# EasyEDA Pro project ProPrj_PCB_PCB_PCB_PCB_STM32F103C8T6(gift)_2023-09-09_2023-10-22_2024-01-15_2025-05-12.epro, board PCB1
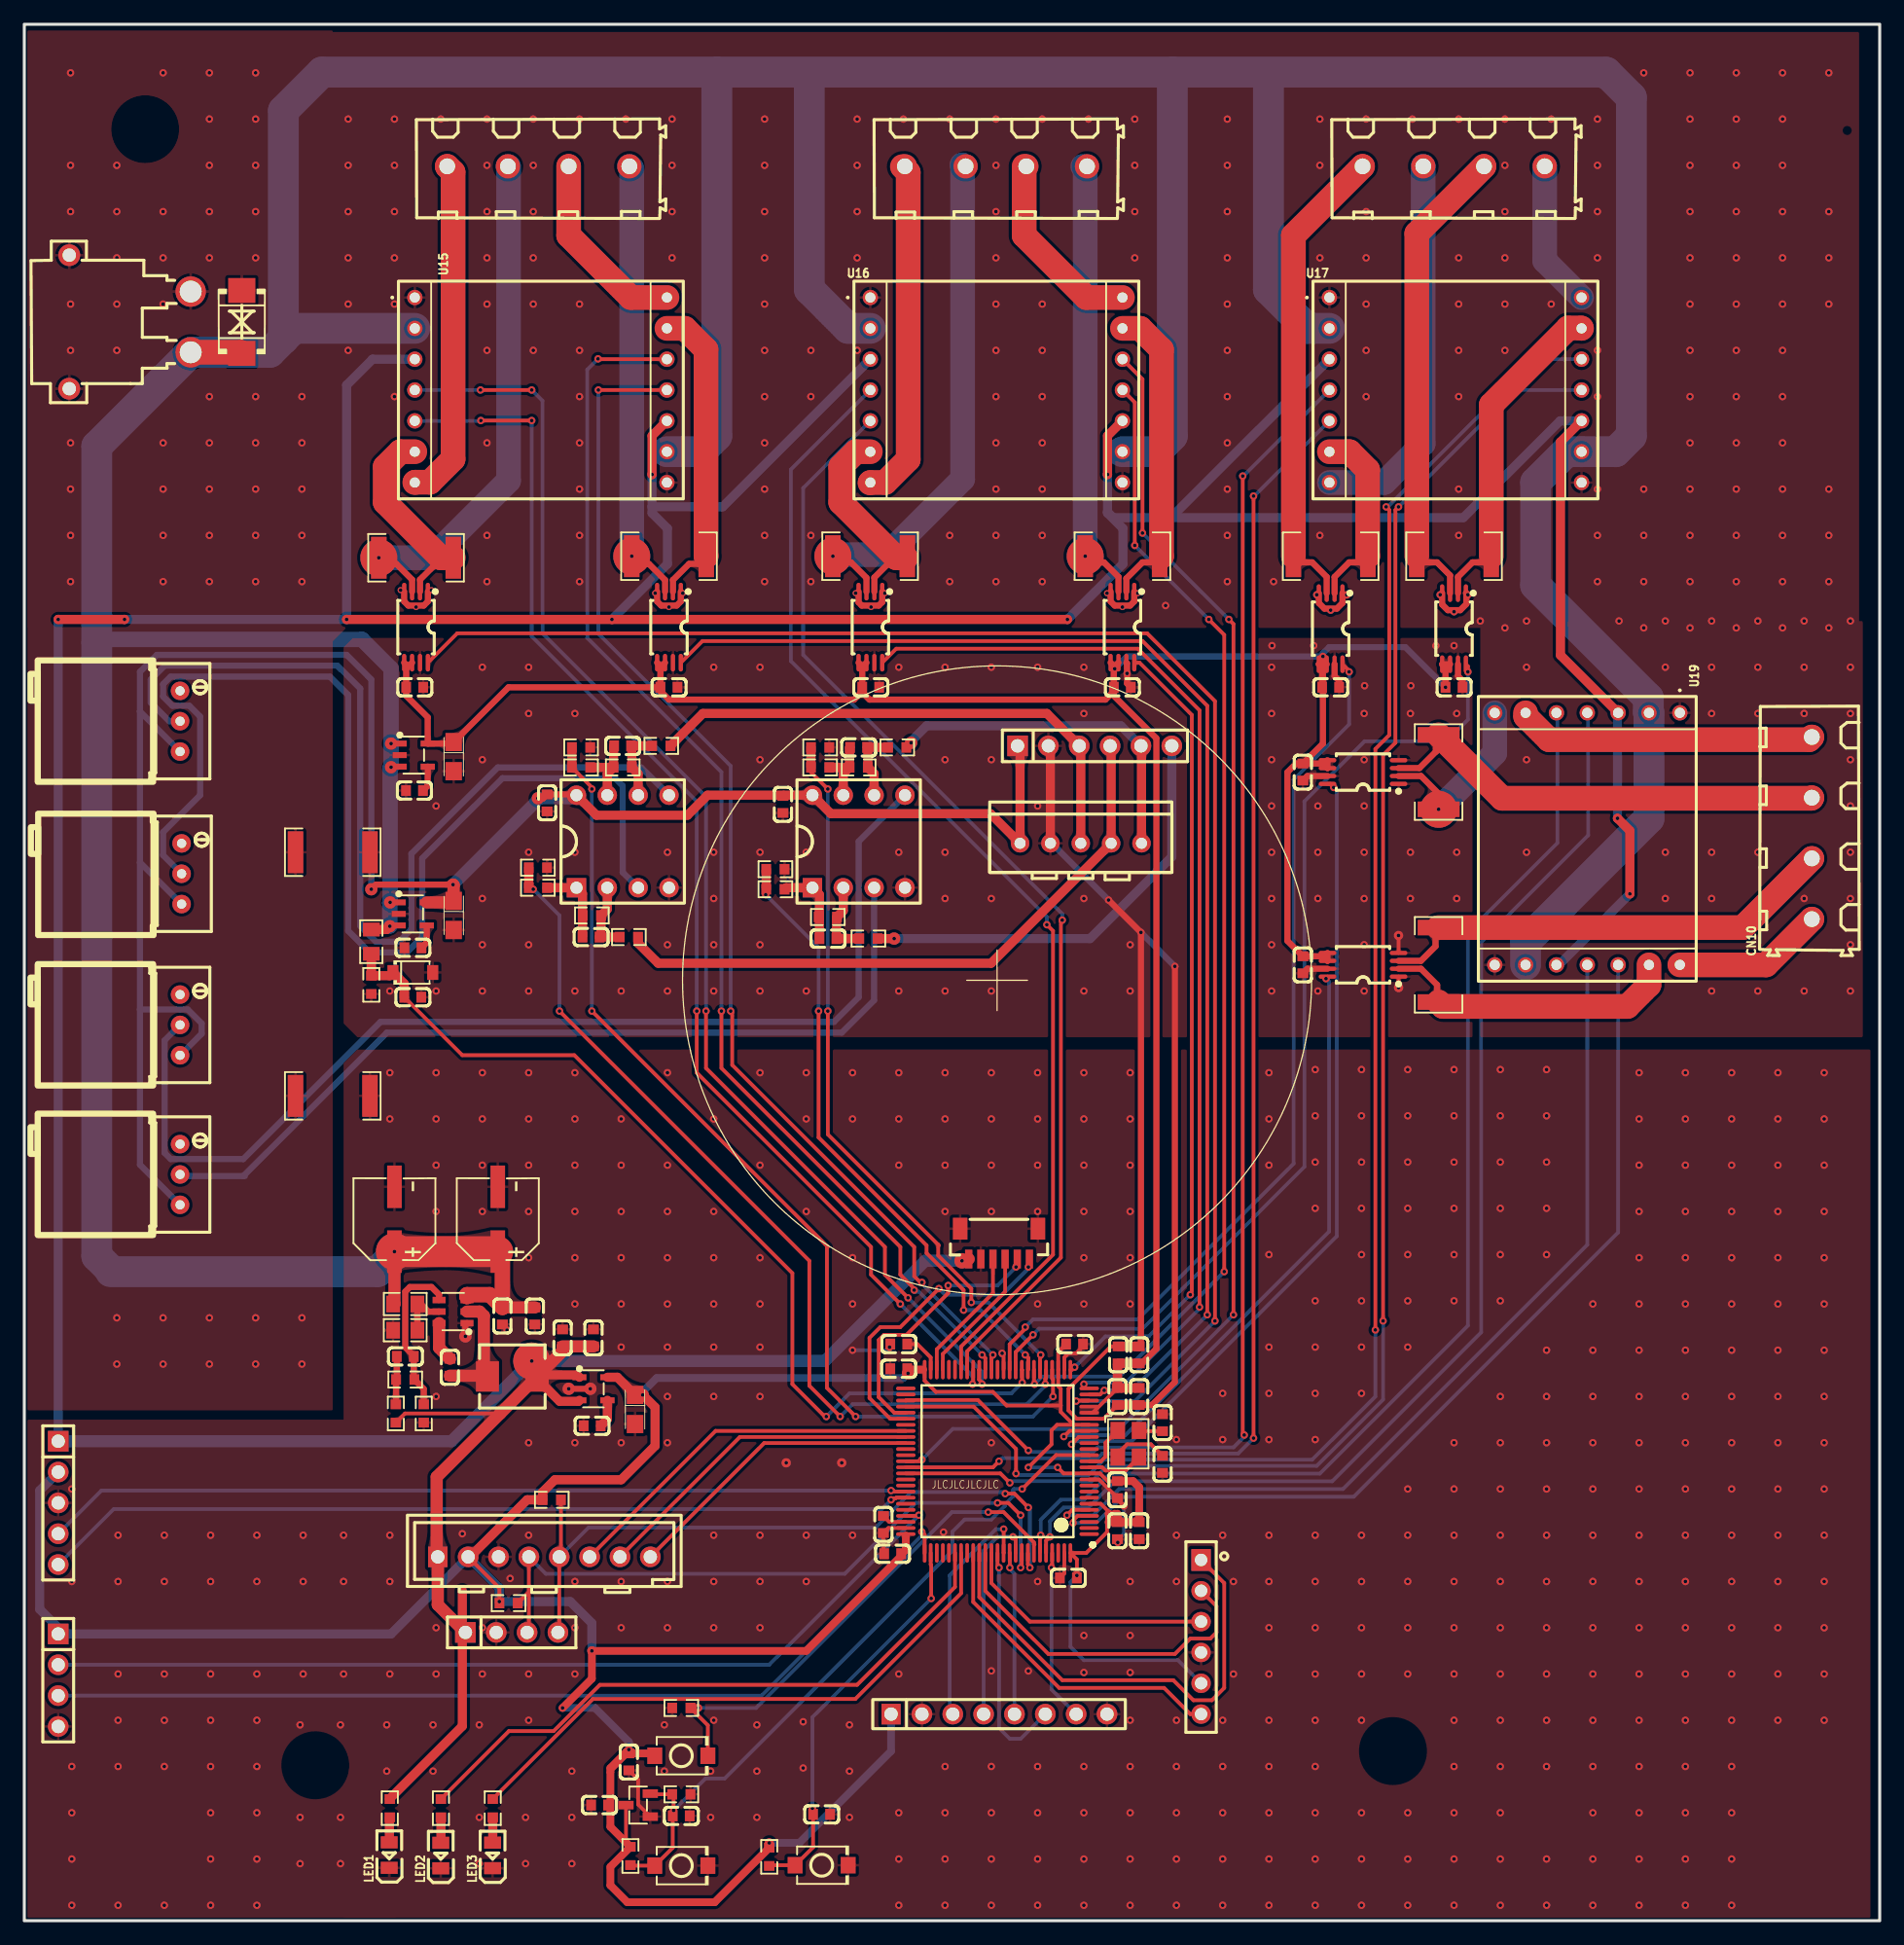
[diagram p4: board, top side]
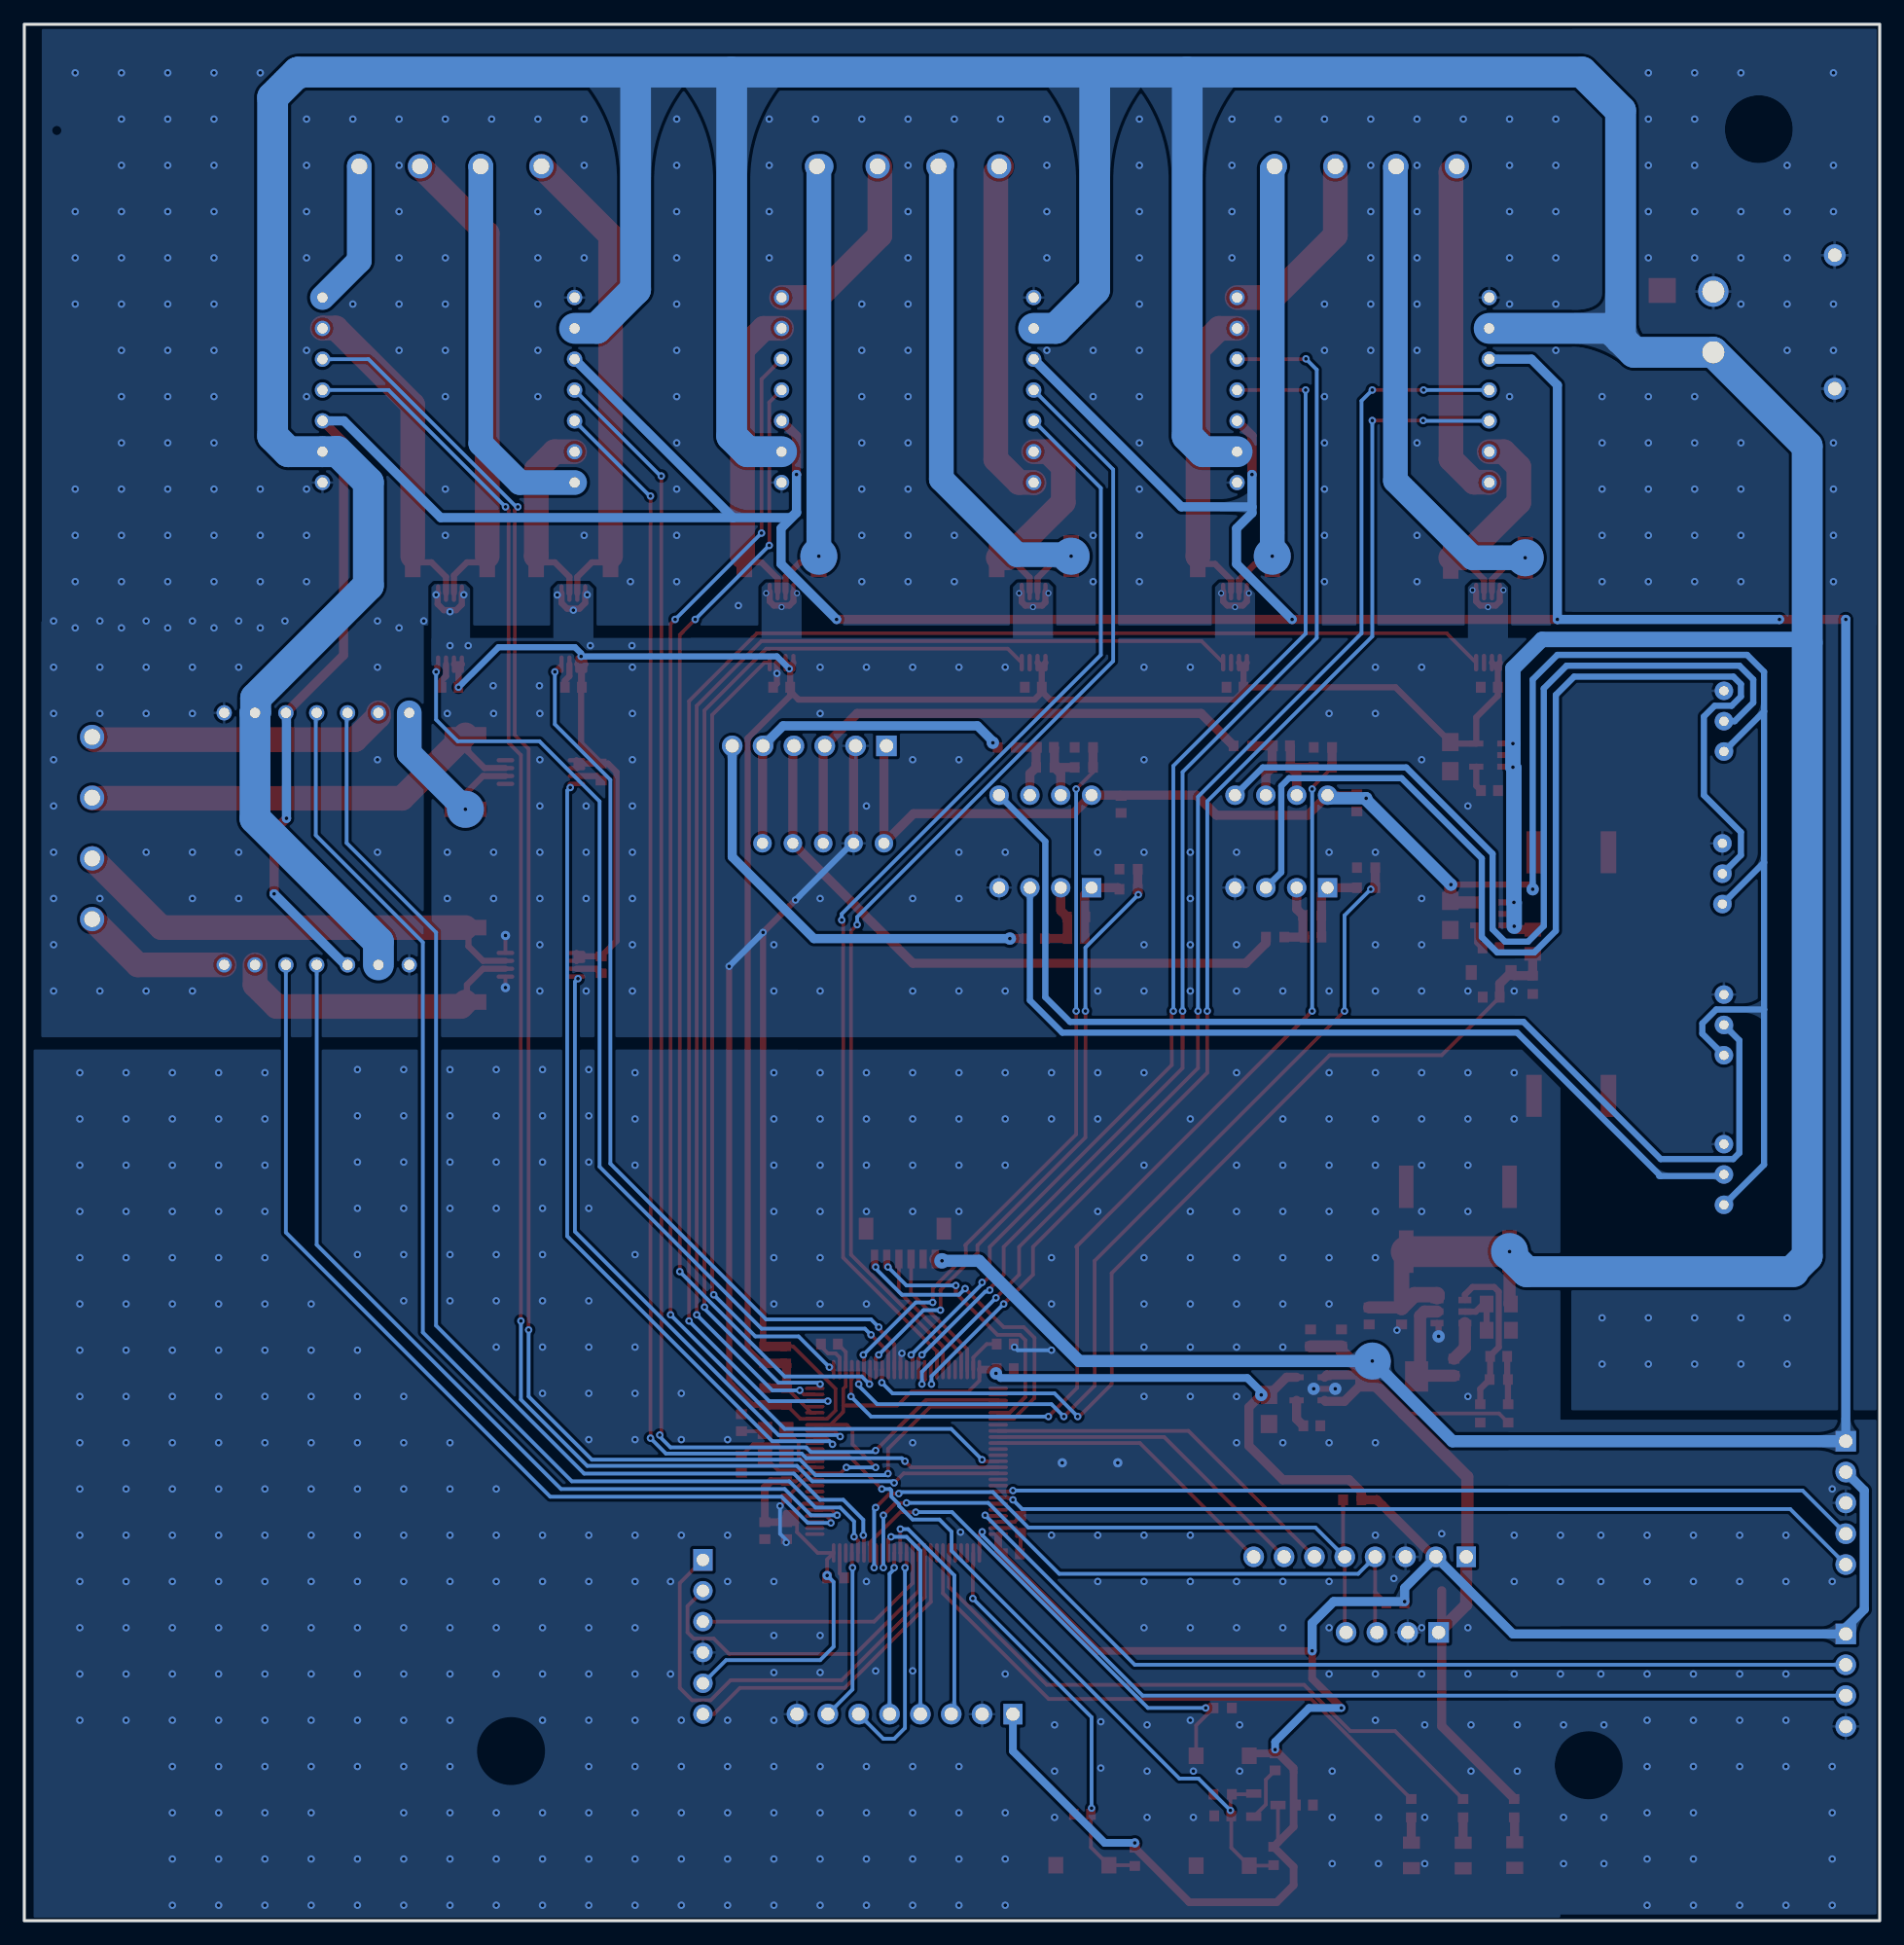
[diagram p5: board, bottom side, seen from below]

Outline 152.78 x 156.21 mm; copper layers: Top Layer, Bottom Layer. Coordinates in mm from the lower left corner of the outline.
Outline path: rectangle 0,156.21 152.78,0
Stack: Top Layer 0.035mm / Dielectric1 1.51mm FR4 er 4.5 / Bottom Layer 0.035mm

## Design rules (mm)
template: JLCPCB Capability(Two Layers Board)
spacing copperThickness1oz (default): track to track 0.102, other pairs 0.152 to 0.3
spacing copperThickness2oz: track to track 0.203, other pairs 0.152 to 0.3
track width copperThickness1oz (default): min 0.127, default 0.254, max 2.54
track width copperThickness2oz: min 0.203, default 0.254, max 2.54
differential pair differentialPair (default): width min 0.127, default 0.254, max 2.54; gap min 0.152, default 0.152
via viaSize (default): diameter min 0.5, default 0.61, max 10; hole min 0.3, default 0.305, max 6.3

## Placement (name value [footprint] x y rotation side)
C1  47uF  [CAP-SMD_BD6.3-L6.6-W6.6-LS7.6-FD]  30.48 57.78 90 top
C2  47uF  [CAP-SMD_BD6.3-L6.6-W6.6-LS7.6-FD]  38.99 57.78 90 top
C3  10uF  [C0603]  42.04 49.82 90 top
C4  100nF  [C0603]  39.37 49.82 90 top
C5  100nF  [C0603]  35.05 45.59 90 top
C6  22uF  [C0603]  44.32 48.01 270 top
C7  22uF  [C0603]  46.86 48.01 270 top
C8  75pF  [C0603]  31.38 46.48 180 top
C9  1uF  [CASE-A_3216]  35.36 82.8 270 top
C10  100nF  [C0603]  32 80.14 0 top
C11  1uF  [CASE-A_3216]  35.36 95.89 270 top
C12  100nF  [C0603]  32.13 93.09 0 top
C13  100nF  [C0603]  53.09 101.6 180 top
C14  100nF  [C0603]  32.15 101.6 180 top
C15  100nF  [C0603]  90.42 101.6 180 top
C16  100nF  [C0603]  69.7 101.6 180 top
C17  100nF  [C0603]  43.05 92.08 270 top
C18  33pF  [C0603]  46.66 81.03 180 top
C19  33pF  [C0603]  49.27 96.77 180 top
C20  100nF  [C0603]  62.47 91.95 270 top
C21  33pF  [C0603]  66.17 80.9 180 top
C22  33pF  [C0603]  68.7 96.65 180 top
C23  1uF  [CASE-A_3216]  50.29 42.11 270 top
C24  100nF  [C0603]  46.76 40.77 0 top
C25  2.2uF  [C0603]  72.01 47.5 180 top
C26  2.2uF  [C0603]  70.74 32.64 270 top
C27  15pF  [C0603]  93.73 37.59 270 top
C28  15pF  [C0603]  93.73 41.02 270 top
C29  100nF  [C0603]  71.5 30.23 0 top
C30  100nF  [C0603]  85.97 28.24 0 top
C31  100nF  [C0603]  90.02 35.51 90 top
C32  100nF  [C0603]  86.49 47.5 180 top
C33  100nF  [C0603]  72.01 45.47 0 top
C34  100nF  [C0603]  90.02 32.13 90 top
C35  100nF  [C0603]  91.8 32.13 90 top
C36  100nF  [C0603]  90.02 43.18 90 top
C37  100nF  [C0603]  90.08 46.61 270 top
C38  10uF  [C0603]  91.8 43.18 90 top
C39  10uF  [C0603]  91.8 46.61 270 top
C40  100nF  [C0603]  54.09 8.64 180 top
C41  100nF  [C0603]  65.65 8.76 180 top
C42  100nF  [C0603]  49.78 13.08 90 top
C43  100nF  [C0603]  31.99 76.07 180 top
C44  100nF  [C0603]  47.37 9.53 0 top
C45  100nF  [C0603]  117.73 101.6 180 top
C46  100nF  [C0603]  107.57 101.6 180 top
C47  100nF  [C0603]  105.28 94.62 90 top
C48  100nF  [C0603]  105.28 78.74 90 top
CN1  XT30PW-M  [CONN-TH_XT30PW-M]  8.7 131.69 270 top
CN3  TOF  [CONN-SMD_A1002WV-S-6P]  80.26 55.75 180 top
CN4  HALL_IN  [CONN-TH_5P-P2.50_HC-XHB-5A]  86.99 88.75 0 top
CN5  WJ127-5.0-4P  [CONN-TH_4P-P5.00_WJ127-5.0-4P]  42.32 144.51 180 top
CN6  WJ127-5.0-4P  [CONN-TH_4P-P5.00_WJ127-5.0-4P]  80.01 144.51 180 top
CN7  WJ127-5.0-4P  [CONN-TH_4P-P5.00_WJ127-5.0-4P]  117.7 144.51 180 top
CN9  UI  [CONN-TH_8P-P2.50_HCTL_HC-XHB-8A]  42.8 29.97 0 top
CN10  WJ127-5.0-4P  [CONN-TH_4P-P5.00_WJ127-5.0-4P]  147.19 90 90 top
D1  TVS  [SMB_L4.6-W3.6-LS5.4-BI]  17.91 131.69 90 top
D2  BZT52C3V3  [SOD-123_L2.7-W1.6-LS3.7-RD]  32 78.11 0 top
H1  IMU  [HDR-TH_8P-P2.54-V-F-3]  80.26 17.02 0 top
H2  PZ254V-11-06P  [HDR-TH_6P-P2.54-V-M]  88.14 96.77 0 top
H3  UART1  [HDR-TH_5P-P2.54-V-M]  2.79 34.42 270 top
H4  BLE  [HDR-TH_6P-P2.54-V-F]  96.9 23.37 270 top
H7  SWD  [HDR-TH_4P-P2.54-V-M]  2.79 19.81 270 top
H8  MF254V-11-04-1000-H70  [HDR-TH_4P-P2.54-V-F-3]  40.13 23.75 0 top
L1  10uH  [IND-SMD_L5.4-W5.2_FXL0530]  40.19 44.83 0 top
LED1  NCD0805R1  [LED0805-R-RD]  30.05 5.41 90 top
LED2  NCD0805G1  [LED0805-R-RD]  34.29 5.37 90 top
LED3  NCD0805B2  [LED0805-R-RD]  38.56 5.38 90 top
R1  511kΩ  [R0805]  31.37 50.8 180 top
R2  105kΩ  [R0805]  31.37 48.64 0 top
R3  49R9  [R0603]  30.59 41.78 270 top
R4  100K  [R0603]  31.37 44.58 180 top
R5  13K3  [R0603]  32.89 41.78 90 top
R6  4.7K  [R0603]  39.88 26.16 180 top
R7  4.7K  [R0603]  43.43 34.67 180 top
R8  0Ω  [R2512]  25.4 67.95 0 top
R9  0Ω  [R2512]  25.4 88.01 0 top
R10  5mΩ  [R2512]  53.09 112.39 0 top
R11  5mΩ  [R2512]  32.26 112.27 0 top
R12  5mΩ  [R2512]  90.42 112.39 0 top
R13  5mΩ  [R2512]  69.65 112.39 0 top
R14  10kΩ  [RES-ADJ-TH_3P-L10.0-W10.0-P2.50-L]  12.83 98.81 270 top
R15  4.7K  [R0603]  49.78 81.02 180 top
R16  100K  [R0603]  46.74 82.8 180 top
R17  4.7K  [R0603]  42.29 85.09 0 top
R18  15K  [R0603]  42.29 86.74 180 top
R19  10kΩ  [RES-ADJ-TH_3P-L10.0-W10.0-P2.50-L]  12.95 86.24 270 top
R20  4.7K  [R0603]  52.45 96.77 180 top
R21  100K  [R0603]  49.28 95 180 top
R22  4.7K  [R0603]  45.85 95 0 top
R23  15K  [R0603]  45.85 96.65 180 top
R24  10kΩ  [RES-ADJ-TH_3P-L10.0-W10.0-P2.50-L]  12.83 73.79 270 top
R25  4.7K  [R0603]  69.51 80.9 180 top
R26  100K  [R0603]  66.17 82.68 180 top
R27  4.7K  [R0603]  61.85 84.96 0 top
R28  15K  [R0603]  61.85 86.61 180 top
R29  10kΩ  [RES-ADJ-TH_3P-L10.0-W10.0-P2.50-L]  12.83 61.47 270 top
R30  4.7K  [R0603]  71.88 96.65 180 top
R31  100K  [R0603]  68.71 95 180 top
R32  4.7K  [R0603]  65.53 95 0 top
R33  15K  [R0603]  65.53 96.65 180 top
R34  1K  [R0603]  30.1 9.27 270 top
R35  1K  [R0603]  34.31 9.27 270 top
R36  1K  [R0603]  38.57 9.27 270 top
R37  10K  [R0603]  49.91 5.33 270 top
R38  10K  [R0603]  61.34 5.26 270 top
R39  10K  [R0603]  54.1 17.53 180 top
R40  100kΩ  [R0805]  28.58 80.64 90 top
R41  10kΩ  [R0603]  28.58 77.09 90 top
R42  100K  [R0603]  54.1 10.41 0 top
R43  5mΩ  [R2512]  117.73 112.39 0 top
R44  5mΩ  [R2512]  107.57 112.39 0 top
R45  5mΩ  [R2512]  116.46 94.62 270 top
R46  5mΩ  [R2512]  116.46 78.74 270 top
SW1  RESET  [SW-SMD_L3.9-W3.0-P4.45]  54.1 4.54 0 top
SW2  KEY  [SW-SMD_L3.9-W3.0-P4.45]  65.66 4.57 0 top
SW3  BOOT0  [SW-SMD_L3.9-W3.0-P4.45]  54.1 13.59 0 top
U3  TPS54302DDCR  [SOT-23-6_L2.9-W1.6-P0.95-LS2.8-BL]  35.31 50.18 90 top
U5  SPX3819-5  [SOT-23-5_L3.0-W1.7-P0.95-LS2.8-BL]  31.99 82.93 270 top
U6  SPX3819-3V3  [SOT-23-5_L3.0-W1.7-P0.95-LS2.8-BL]  32.07 96.01 270 top
U7  INA240A2  [TSSOP-8_L4.4-W3.0-P0.65-LS6.4-BL]  53.09 106.55 180 top
U8  INA240A2  [TSSOP-8_L4.4-W3.0-P0.65-LS6.4-BL]  32.26 106.55 180 top
U9  INA240A2  [TSSOP-8_L4.4-W3.0-P0.65-LS6.4-BL]  90.42 106.55 180 top
U10  INA240A2  [TSSOP-8_L4.4-W3.0-P0.65-LS6.4-BL]  69.67 106.55 180 top
U11  -  [DIP-8_L10.2-W10.2-P2.54-LS7.6-BL]  49.28 88.9 0 top
U12  -  [DIP-8_L10.2-W10.2-P2.54-LS7.6-BL]  68.71 88.9 0 top
U13  SPX3819-3V3  [SOT-23-5_L3.0-W1.7-P0.95-LS2.8-BL]  46.86 43.81 270 top
U14  STM32F407VET6  [LQFP-100_L14.0-W14.0-P0.50-LS16.0-BL]  80.14 37.85 90 top
U15  AT8236  [AT8236-Dual-Module]  42.54 126.03 0 top
U16  AT8236  [AT8236-Dual-Module]  80.05 126.03 0 top
U17  AT8236  [AT8236-Dual-Module]  117.85 126.03 0 top
U18  MAX809T  [SOT-23-3_L2.9-W1.3-P1.90-LS2.4-BR]  50.55 9.53 0 top
U19  AT8236  [AT8236-Dual-Module]  128.65 89.11 270 top
U20  INA240A2  [TSSOP-8_L4.4-W3.0-P0.65-LS6.4-BL]  117.73 106.43 180 top
U21  INA240A2  [TSSOP-8_L4.4-W3.0-P0.65-LS6.4-BL]  107.57 106.43 180 top
U22  INA240A2  [TSSOP-8_L4.4-W3.0-P0.65-LS6.4-BL]  110.24 94.62 90 top
U23  INA240A2  [TSSOP-8_L4.4-W3.0-P0.65-LS6.4-BL]  110.24 78.74 90 top
X1  8MHz  [OSC-SMD_4P-L3.2-W2.5-BL]  90.91 39.28 270 top

## Footprints (pads in the part's own frame, mm; a bottom-side part is the same pattern mirrored in y, then rotated)
AT8236-Dual-Module
  round 1.26 hole 0.84: 1(-10.38,7.671) 2(-10.38,5.131) 3(-10.38,2.591) 4(-10.38,0.051) 5(-10.38,-2.489) 6(-10.38,-5.029) 7(-10.38,-7.569) 8(10.38,7.671) 9(10.38,5.131) 10(10.38,2.591) 11(10.38,0.051) 12(10.38,-2.489) 13(10.38,-5.029) 14(10.38,-7.569)
C0603
  rect 0.8x0.9 smd: 1(-0.7,0) 2(0.7,0)
CAP-SMD_BD6.3-L6.6-W6.6-LS7.6-FD
  rect 3.5x1.2 smd: 1(-2.67,0) 2(2.67,0)
CASE-A_3216
  rect 1.5x1.359 smd: 1(-1.2,0) 2(1.2,0)
CONN-SMD_A1002WV-S-6P
  rect 0.6x1.55 smd: 1(2.499,1.251) 2(1.499,1.251) 3(0.501,1.25) 4(-0.501,1.251) 5(-1.501,1.251) 6(-2.501,1.251)
  rect 1.2x1.8 smd: 7(3.201,-1.251) 8(-3.201,-1.251)
CONN-TH_4P-P5.00_WJ127-5.0-4P
  round 2 hole 1.3: 1(-7.5,0) 2(-2.5,0) 3(2.5,0) 4(7.5,0)
CONN-TH_5P-P2.50_HC-XHB-5A
  round 1.524 hole 0.914: 1(-5,0) 2(-2.5,0) 3(0,0) 4(2.5,0) 5(5,0)
CONN-TH_8P-P2.50_HCTL_HC-XHB-8A
  rect 1.6x1.7 hole 1.1: 1(-8.75,0)
  round 1.7 hole 1.1: 2(-6.25,0) 3(-3.75,0) 4(-1.25,0) 5(1.25,0) 6(3.75,0) 7(6.25,0) 8(8.75,0)
CONN-TH_XT30PW-M
  round 2.5 hole 1.8: 1(-2.5,5) 2(2.5,5)
  round 1.8 hole 1.1: 3(5.5,-5) 4(-5.5,-5)
DIP-8_L10.2-W10.2-P2.54-LS7.6-BL
  rect 1.6x1.6 hole 1: 1(-3.808,-3.81)
  round 1.6 hole 1: 2(-1.27,-3.81) 3(1.27,-3.81) 4(3.81,-3.81) 5(3.81,3.81) 6(1.27,3.81) 7(-1.27,3.81) 8(-3.81,3.81)
HDR-TH_4P-P2.54-V-F-3
  rect 1.7x1.7 hole 1.1: 1(-3.81,0)
  round 1.7 hole 1.1: 2(-1.27,0) 3(1.27,0) 4(3.81,0)
HDR-TH_4P-P2.54-V-M
  rect 1.7x1.7 hole 1.1: 1(-3.81,0)
  round 1.7 hole 1.1: 2(-1.27,0) 3(1.27,0) 4(3.81,0)
HDR-TH_5P-P2.54-V-M
  rect 1.7x1.7 hole 1.1: 1(-5.08,0)
  round 1.7 hole 1.1: 2(-2.54,0) 3(0,0) 4(2.54,0) 5(5.08,0)
HDR-TH_6P-P2.54-V-F
  rect 1.8x1.6 hole 1.02: 1(-6.35,0)
  round 1.6 hole 1.02: 2(-3.81,0) 3(-1.27,0) 4(1.27,0) 5(3.81,0) 6(6.35,0)
HDR-TH_6P-P2.54-V-M
  rect 1.7x1.7 hole 1.1: 1(-6.35,0)
  round 1.7 hole 1.1: 2(-3.81,0) 3(-1.27,0) 4(1.27,0) 5(3.81,0) 6(6.35,0)
HDR-TH_8P-P2.54-V-F-3
  rect 1.575x1.7 hole 1.1: 1(-8.89,0)
  round 1.7 hole 1.1: 2(-6.35,0) 3(-3.81,0) 4(-1.27,0) 5(1.27,0) 6(3.81,0) 7(6.35,0) 8(8.89,0)
IND-SMD_L5.4-W5.2_FXL0530
  rect 1.9x2.5 smd: 1(-2.05,0) 2(2.05,0)
LED0805-R-RD
  rect 1x1.399 smd: 1(1.05,0) 2(-1.05,0)
LQFP-100_L14.0-W14.0-P0.50-LS16.0-BL
  oval 0.3x1.6 smd: 1(-6,-7.55) 2(-5.5,-7.55) 3(-5,-7.55) 4(-4.5,-7.55) 5(-4,-7.55) 6(-3.5,-7.55) 7(-3,-7.55) 8(-2.5,-7.55) 9(-2,-7.55) 10(-1.5,-7.55) 11(-1,-7.55) 12(-0.5,-7.55) 13(0,-7.55) 14(0.5,-7.55) 15(1,-7.55) 16(1.5,-7.55) 17(2,-7.55) 18(2.5,-7.55) 19(3,-7.55) 20(3.5,-7.55) 21(4,-7.55) 22(4.5,-7.55) 23(5,-7.55) 24(5.5,-7.55) 25(6,-7.55) 51(6,7.55) 52(5.5,7.55) 53(5,7.55) 54(4.5,7.55) 55(4,7.55) 56(3.5,7.55) 57(3,7.55) 58(2.5,7.55) 59(2,7.55) 60(1.5,7.55) 61(1,7.55) 62(0.5,7.55) 63(0,7.55) 64(-0.5,7.55) 65(-1,7.55) 66(-1.5,7.55) 67(-2,7.55) 68(-2.5,7.55) 69(-3,7.55) 70(-3.5,7.55) 71(-4,7.55) 72(-4.5,7.55) 73(-5,7.55) 74(-5.5,7.55) 75(-6,7.55)
  oval 1.6x0.3 smd: 26(7.55,-6) 27(7.55,-5.5) 28(7.55,-5) 29(7.55,-4.5) 30(7.55,-4) 31(7.55,-3.5) 32(7.55,-3) 33(7.55,-2.5) 34(7.55,-2) 35(7.55,-1.5) 36(7.55,-1) 37(7.55,-0.5) 38(7.55,0) 39(7.55,0.5) 40(7.55,1) 41(7.55,1.5) 42(7.55,2) 43(7.55,2.5) 44(7.55,3) 45(7.55,3.5) 46(7.55,4) 47(7.55,4.5) 48(7.55,5) 49(7.55,5.5) 50(7.55,6) 76(-7.55,6) 77(-7.55,5.5) 78(-7.55,5) 79(-7.55,4.5) 80(-7.55,4) 81(-7.55,3.5) 82(-7.55,3) 83(-7.55,2.5) 84(-7.55,2) 85(-7.55,1.5) 86(-7.55,1) 87(-7.55,0.5) 88(-7.55,0) 89(-7.55,-0.5) 90(-7.55,-1) 91(-7.55,-1.5) 92(-7.55,-2) 93(-7.55,-2.5) 94(-7.55,-3) 95(-7.55,-3.5) 96(-7.55,-4) 97(-7.55,-4.5) 98(-7.55,-5) 99(-7.55,-5.5) 100(-7.55,-6)
OSC-SMD_4P-L3.2-W2.5-BL
  rect 1.4x1.2 smd: 1(-1.1,-0.875) 2(1.1,-0.875) 3(1.1,0.875) 4(-1.1,0.875)
R0603
  rect 0.806x0.864 smd: 1(-0.753,0) 2(0.753,0)
R0805
  rect 1.133x1.377 smd: 1(-1,0) 2(1,0)
R2512
  rect 1.282x3.456 smd: 1(-3.067,0) 2(3.067,0)
RES-ADJ-TH_3P-L10.0-W10.0-P2.50-L
  round 1.524 hole 0.762: 1(-2.5,0) 2(0,0) 3(2.5,0)
SMB_L4.6-W3.6-LS5.4-BI
  rect 2.047x2.241 smd: 1(-2.591,0) 2(2.591,0)
SOD-123_L2.7-W1.6-LS3.7-RD
  rect 0.91x1.22 smd: 1(-1.635,0) 2(1.635,0)
SOT-23-3_L2.9-W1.3-P1.90-LS2.4-BR
  rect 1.25x0.7 smd: 1(1,-0.95) 2(1,0.95) 3(-1,0)
SOT-23-5_L3.0-W1.7-P0.95-LS2.8-BL
  rect 0.49x1.157 smd: 1(-0.95,-1.153) 2(0,-1.153) 3(0.95,-1.153)
  rect 0.49x1.175 smd: 4(0.95,1.153) 5(-0.95,1.153)
SOT-23-6_L2.9-W1.6-P0.95-LS2.8-BL
  rect 0.532x1.072 smd: 1(-0.95,-1.149) 2(0,-1.149) 3(0.95,-1.149) 4(0.95,1.149) 5(0,1.149) 6(-0.95,1.149)
SW-SMD_L3.9-W3.0-P4.45
  rect 1.23x1.36 smd: 1(-2.185,0) 2(2.185,0)
TSSOP-8_L4.4-W3.0-P0.65-LS6.4-BL
  oval 0.353x1.454 smd: 1(-0.975,-2.927) 2(-0.325,-2.927) 3(0.325,-2.927) 4(0.975,-2.927) 5(0.975,2.927) 6(0.325,2.927) 7(-0.325,2.927) 8(-0.975,2.927)

## Nets
As in the schematic.

## Via types
v1: diameter 0.61, hole 0.305, Top Layer to Bottom Layer, 947 vias
v2: diameter 0.762, hole 0.305, Top Layer to Bottom Layer, 16 vias
v3: diameter 3.048, hole 0.305, Top Layer to Bottom Layer, 7 vias
v4: diameter 1.27, hole 0.305, Top Layer to Bottom Layer, 1 via
v5: diameter 1.016, hole 0.305, Top Layer to Bottom Layer, 14 vias
v6: diameter 0.5, hole 0.305, Top Layer to Bottom Layer, 12 vias

## Routing (per net, layer and track width the routed paths; a pad name or vN(x,y) marks a point on that pad's centre or on a via; arc(x,y) is an arc through that point)
3V3: length 291.6
  Top Layer w0.305: 86.41,40.85 85.34,41.91 85.34,42.44 ; 86.41,40.85 85.04,40.85 84.58,40.39 84.58,39.24 v1(82.68,37.34) ; 86.41,40.85 U14.19 ; U14.6 88.64,34.35 89.33,33.66 89.15,33.48 89.15,32 87.45,30.3 U14.100 86.67,29.76 C30.2 ; 72.59,31.73 72.59,31.85 ; C33.2 72.78,45.4 73.08,45.4 ; CN9.2 39.12,27.4 R6.2 ; C32.2 85.14,46.85 U14.28 85.14,44.02 85.34,43.81 85.34,42.44 ; 85.34,42.44 80.88,42.44 79.76,43.56 75.06,43.56 74.14,44.48 U14.50 74.02,45.4 ; U18.3 49.55,6.45 ; 48.26,12.26 C42.2 ; v1(85.09,37.34) 85.58,36.85 U14.11 88.57,36.85 89.22,36.19 90,36.19 90.02,36.21
  Top Layer w0.635: C34.2 C35.2 91.8,35.7 91.3,36.21 90.02,36.21 ; C34.2 89.28,32.83 ; C34.2 89.32,33.53 89.28,33.53 ; C34.2 90.17,32.99 ; C34.2 90.02,33.3 ; 90.02,33.3 90.02,33.53 ; 90.02,33.3 89.79,33.53 ; R38.1 56.85,1.52 49.66,1.52 48.26,2.92 48.26,4.44 R37.1 48.26,7.74 48.26,12.57 v1(49.78,14.1) ; v5(72.77,45.09) 73.08,45.4 74.02,45.4 ; SW3.1 51.72,13.78 C42.2 ; v1(44.32,17.53) 46.74,19.94 v2(46.74,22.22) 64.39,22.22 72.2,30.04 C29.2 72.26,30.23 72.59,30.55 72.59,31.73
  Top Layer w0.75: C23.1 48.84,44.77 U13.5 ; CN9.2 36.7,29.97 41.4,34.67 R7.2 42.68,35.31 43.69,36.32 49.15,36.32 51.94,39.12 51.94,42.29 v5(50.93,43.31)
  Bottom Layer w0.305: v1(85.09,37.34) v1(82.68,37.34) ; H4.5 95,21.46 87.25,21.46 86.14,22.57 86.14,27.91 v2(86.67,28.44)
  Bottom Layer w0.635: v5(72.77,45.09) 72.39,44.7 52.07,44.7 50.93,43.56 v5(50.93,43.31) ; v2(61.34,6.41) 63.81,6.41 71.37,13.97 H1.1 ; v1(44.32,17.53) 46.99,17.53 49.78,14.73 v1(49.78,14.1)
  Bottom Layer w0.75: H3.2 1.27,35.43 1.27,25.65 2.79,24.13 H7.1 30.2,23.62 CN9.2 39.12,27.41 v1(39.12,26.29) 44.96,26.29 46.74,24.51 46.74,22.35
+5V: length 500
  Top Layer w0.305: 39.19,41.78 31.35,41.78 R3.2 ; L1.2 41.78,44.38
  Top Layer w0.75: v2(85.89,107.19) v2(48.39,107.19) v2(26.54,107.19) ; 42.8,44.83 42.93,44.96 45.52,44.96 U13.1 ; 42.8,44.83 42.8,44.07 44.09,42.78 45.62,42.78 U13.3 ; 42.8,44.83 L1.2 ; v2(51.69,119.13) 51.69,122.32 U15.12 ; v2(89.2,119.13) 89.2,122.32 U16.12 ; 30.07,10.02 36.07,16.03 36.07,27.18 ; v2(2.79,107.19) v2(8.25,107.19) ; U19.3 126.49,104.24 126.49,121.81 U17.12 ; v2(131.19,90.81) 132.21,89.79 v2(132.21,84.58)
  Top Layer w1: C6.2 C7.2 ; L1.2 44.32,46.92 44.32,47.22 ; H8.1 34.05,26.02 CN9.1 33.96,30.06 33.96,36.55 41.78,44.38 v3(41.78,46.1) ; v4(77.22,54.36) 77.62,54.36 CN3.1
  Bottom Layer w0.75: U19.3 131.19,99.44 v2(131.19,90.81) ; U16.3 57.51,116.47 51.69,116.47 ; 89.2,116.03 89.66,115.57 94.41,115.57 ; 89.2,116.03 v2(89.2,119.13) ; 89.2,116.03 89.2,115.95 90.47,114.68 90.47,111.76 v2(85.89,107.19) ; U15.3 28.67,128.62 26.54,126.49 v2(26.54,107.19) v2(8.25,107.19) ; v2(2.79,107.19) H3.1 ; 94.41,115.57 U17.3 ; 94.41,115.57 118.49,115.57 126.46,123.54 U17.12 ; v2(48.39,107.19) 52.96,111.76 52.96,114.68 51.69,115.95 51.69,116.47 ; v2(132.21,84.58) 126.36,78.73 U19.12 ; v2(51.69,119.13) 51.69,116.47
  Bottom Layer w1: H3.1 35.18,39.5 v3(41.78,46.1) 65.91,46.1 74.17,54.36 76.96,54.36
A3V3: length 210.3
  Top Layer w0.305: C36.2 87.98,41.85 U14.21
  Top Layer w0.508: 69,103.28 69,103.33 U10.5 ; 69,103.28 C16.2 69,101.26 ; 69,103.28 U10.6 ; 106.89,103.5 106.59,103.5 106.87,103.22 106.87,101.6 ; 106.89,103.5 106.93,103.54 ; 106.89,103.5 106.93,103.5 ; 31.45,103.14 U8.6 ; 31.45,103.14 31.45,103.46 U8.5 ; 31.45,103.14 C14.2 31.45,100.9 33.22,99.12 U6.5 35.23,96.96 C11.1 39.87,101.6 C13.2 ; 52.39,103.25 52.39,103.35 U7.5 ; 52.39,103.25 U7.6 ; 52.39,103.25 C13.2 ; 91.8,45.91 92.01,45.91 93.22,47.12 93.22,97.39 89.72,100.9 89.72,101.27 ; 69,101.26 68.33,100.58 53.09,100.58 52.39,101.28 C13.2 ; 69,101.26 69,101.18 69.6,100.58 89.03,100.58 89.72,101.27 ; C47.2 106.93,96.97 106.93,103.5 ; C47.2 104.72,95.31 104.01,94.6 104.01,80.71 C48.2 106.93,79.44 107.31,79.06 107.31,79.72 ; C47.2 106.93,95.31 107.31,94.94 107.31,95.59 ; 89.72,101.27 C15.2 89.72,103.24 ; v1(117.03,101.6) 117.03,103.22 116.75,103.5 117.4,103.5 ; 106.93,103.54 v1(106.93,104.14) ; 106.93,103.54 106.93,103.5 ; 106.93,103.5 107.24,103.5 ; 89.72,103.24 U9.6 ; 89.72,103.24 89.72,103.36 U9.5
  Top Layer w0.75: C38.2 C36.2 90.02,45.85 90.08,45.91 91.8,45.91
  Bottom Layer w0.508: v1(89.79,103.12) 90.8,104.14 v1(106.93,104.14) 106.93,104.39 107.44,104.9 113.73,104.9 v1(117.03,101.6)
AGND: length 147
  Top Layer w0.305: C37.1 89.47,47.31 85.98,43.81 85.98,42.04 86.67,41.35 U14.20 88.88,41.35 C36.1 ; v2(113.16,76.86) 113.16,77.77 ; v2(113.16,81.15) 113.16,81.15 U23.4
  Top Layer w0.5: v1(94.74,78.61) 94.74,44.37 92.85,42.48 C38.1 ; U9.7 90.8,103.57 v1(90.8,102.74) 90.8,101.91 C15.1
  Top Layer w0.508: 118.05,103.5 118.05,102.52 118.43,102.14 C45.1 ; 107.31,94.29 105.66,94.29 C47.1 ; 107.31,78.42 105.66,78.42 C48.1 ; 107.89,103.5 107.89,102.52 108.27,102.14 C46.1 ; U9.4 89.45,108.67 89.79,108.33 91.06,108.33 91.4,108.67 U9.1 ; U8.1 33.23,108.67 32.89,108.33 31.62,108.33 31.28,108.67 U8.4 ; U10.4 68.7,108.59 68.96,108.33 70.36,108.33 70.65,108.62 70.65,109.48 ; 91.76,47.31 91.95,47.5 v1(91.95,81.41) v1(89.28,84.07) ; U21.1 108.54,108.54 108.08,108.08 107.06,108.08 106.59,108.54 U21.4 ; U7.1 54.06,108.67 53.72,108.33 52.45,108.33 52.11,108.67 U7.4 ; U20.1 118.74,109.31 118.74,108.46 118.24,107.95 117.22,107.95 116.75,108.42 U20.4
  Top Layer w0.75: C36.1 C38.1 ; H2.2 84.49,96.61 CN4.2 ; C37.1 C39.1
  Bottom Layer w0.508: v1(94.74,78.61) v1(91.95,81.41) ; v1(89.28,84.07) 84.61,88.75 CN4.2
  vias: v1(30.1,76.58) v1(33.91,91.82) v1(33.91,76.58) v1(37.72,103.25) v1(37.72,95.63) v1(37.72,84.2) v1(37.72,80.39) v1(37.72,76.58) v1(41.53,103.25) v1(41.53,99.44) v1(41.53,88.01) v1(41.53,80.39) v1(41.53,76.58) v1(45.34,99.44) v1(45.34,88.01) v1(45.34,76.58) v1(49.15,76.58) v1(52.96,88.01) v1(52.96,80.39) v1(52.96,76.58) v1(56.77,103.25) v1(56.77,88.01) v1(56.77,84.2) v1(56.77,80.39) v1(56.77,76.58) v1(60.58,103.25) v1(60.58,95.63) v1(60.58,88.01) v1(60.58,80.39) v1(60.58,76.58) v1(64.39,88.01) v1(64.39,76.58) v1(72.01,103.25) v1(72.01,88.01) v1(72.01,76.58) v1(75.82,103.25) v1(75.82,95.63) v1(75.82,88.01) v1(75.82,84.2) v1(75.82,76.58) v1(79.63,103.25) v1(79.63,95.63) v1(79.63,84.2) v1(79.63,76.58) v1(83.44,103.25) v1(83.44,91.82) v1(87.25,103.25) v1(87.25,99.44) v1(87.25,84.2) v1(87.25,76.58) v1(91.06,80.39) v1(91.06,76.58) v1(102.71,103.25) v1(102.71,99.44) v1(102.71,95.63) v1(102.71,91.82) v1(102.71,88.01) v1(102.71,84.2) v1(102.71,80.39) v1(102.71,76.58) v1(102.74,105.03) v1(106.17,105.03) v1(106.43,109.22) v1(106.52,91.82) v1(106.52,88.01) v1(106.52,84.2) v1(106.52,76.58) v1(107.57,107.95) v1(108.89,109.2) v1(110.33,99.44) v1(110.33,95.63) v1(110.33,91.82) v1(110.33,88.01) v1(110.33,84.2) v1(110.33,80.39) v1(110.33,76.58) v1(110.36,101.73) v1(114.14,99.44) v1(114.14,88.01) v1(114.14,84.2) v1(114.17,101.73) v1(116.23,105.03) v1(116.59,109.22) v1(117.73,107.82) v1(117.73,105.03) v1(117.95,99.44) v1(117.95,88.01) v1(117.95,84.2) v1(118.87,109.22) v6(30.99,109.6) v6(32.26,108.2) v6(33.53,109.6) v6(51.94,109.35) v6(53.09,108.2) v6(54.23,109.35) v6(68.45,109.35) v6(69.72,108.2) v6(70.87,109.35) v6(89.15,109.35) v6(90.42,108.2) v6(91.69,109.35)
GND: length 26.2
  Top Layer w0.305: C32.1 87.19,47.31 86.61,46.74 85.98,46.74 85.64,46.39 U14.27 ; 72.59,32.35 71.15,32.35 C26.2 70.74,30.29 C29.1 ; U14.37 80.64,46.62 v1(80.52,46.74) ; U14.10 88.49,36.35 90.02,34.83 C31.1 90.02,34.7 v1(90.55,34.16) ; U18.1 50.55,9.57 50.55,11.62 C42.1 ; U14.99 85.64,28.6 C30.1
  Top Layer w0.508: U3.1 36.32,49.09 v5(36.32,48.13)
  Bottom Layer w0.305: v1(68.2,46.99) 71,46.99 v1(71.25,47.24) ; 90.04,31.37 90.55,31.88 v1(90.55,34.16)
  vias: v1(3.91,35.56) v1(3.91,27.94) v1(3.91,12.7) v1(3.91,8.89) v1(3.91,5.08) v1(3.91,1.27) v1(7.72,31.75) v1(7.72,27.94) v1(7.72,20.32) v1(7.72,16.51) v1(7.72,12.7) v1(7.72,1.27) v1(11.53,31.75) v1(11.53,27.94) v1(11.53,20.32) v1(11.53,16.51) v1(11.53,12.7) v1(11.53,1.27) v1(15.34,31.75) v1(15.34,27.94) v1(15.34,20.32) v1(15.34,16.51) v1(15.34,12.7) v1(15.34,8.89) v1(15.34,5.08) v1(15.34,1.27) v1(19.15,31.75) v1(19.15,27.94) v1(19.15,20.32) v1(19.15,16.51) v1(19.15,12.7) v1(19.15,8.89) v1(19.15,5.08) v1(19.15,1.27) v1(22.71,16.13) v1(22.71,8.51) v1(22.71,4.7) v1(22.96,31.75) v1(22.96,27.94) v1(22.96,20.32) v1(26.03,16.13) v1(26.03,8.51) v1(26.03,4.7) v1(26.29,31.75) v1(26.29,27.94) v1(26.29,20.32) v1(29.84,16.13) v1(29.84,12.32) v1(30.1,69.85) v1(30.1,66.04) v1(30.1,31.75) v1(30.1,27.94) v1(30.1,20.32) v1(33.66,16.13) v1(33.66,12.32) v1(33.91,69.85) v1(33.91,66.04) v1(33.91,62.23) v1(33.91,58.42) v1(33.91,43.18) v1(33.91,24.13) v1(33.91,20.32) v1(36.07,31.88) v1(37.47,16.13) v1(37.47,8.51) v1(37.47,4.7) v1(37.72,69.85) v1(37.72,66.04) v1(37.72,62.23) v1(37.72,58.42) v1(37.72,24.13) v1(37.72,20.32) v1(39.75,48.64) v1(40,28.19) v1(41.27,8.51) v1(41.27,4.7) v1(41.53,69.85) v1(41.53,66.04) v1(41.53,62.23) v1(41.53,58.42) v1(41.53,54.61) v1(41.53,39.37) v1(41.53,31.75) v1(41.53,20.32) v1(41.53,16.51) v1(45.08,12.32) v1(45.08,8.51) v1(45.08,4.7) v1(45.34,69.85) v1(45.34,66.04) v1(45.34,62.23) v1(45.34,58.42) v1(45.34,54.61) v1(45.34,50.8) v1(45.34,39.37) v1(45.34,27.94) v1(45.34,24.13) v1(45.34,20.32) v1(49.15,66.04) v1(49.15,62.23) v1(49.15,58.42) v1(49.15,54.61) v1(49.15,50.8) v1(49.15,47.25) v1(49.15,39.37) v1(49.15,27.94) v1(49.15,24.13) v1(52.7,16.13) v1(52.7,12.32) v1(52.96,69.85) v1(52.96,62.23) v1(52.96,58.42) v1(52.96,54.61) v1(52.96,50.8) v1(52.96,47.25) v1(52.96,43.18) v1(52.96,39.37) v1(52.96,27.94) v1(52.96,24.13) v1(56.52,12.32) v1(56.52,8.51) v1(56.77,66.04) v1(56.77,58.42) v1(56.77,54.61) v1(56.77,50.8) v1(56.77,47.25) v1(56.77,43.18) v1(56.77,31.75) v1(56.77,27.94) v1(56.77,24.13) v1(56.77,16.51) v1(60.33,16.13) v1(60.33,12.32) v1(60.33,8.51) v1(60.58,69.85) v1(60.58,62.23) v1(60.58,54.61) v1(60.58,50.8) v1(60.58,47.25) v1(60.58,43.18) v1(60.58,31.75) v1(60.58,27.94) v1(60.58,24.13) v1(64.14,16.39) v1(64.14,12.58) v1(64.39,69.85) v1(64.39,66.04) v1(64.39,58.42) v1(64.39,31.75) v1(64.39,27.94) v1(67.95,16.13) v1(67.95,12.32) v1(67.95,8.51) v1(68.2,69.85) v1(68.2,66.04) v1(68.2,54.61) v1(68.2,50.8) v1(68.2,31.75) v1(72.01,69.85) v1(72.01,66.04) v1(72.01,62.23) v1(72.01,20.32) v1(72.01,8.89) v1(72.01,5.08) v1(72.01,1.27) v1(75.69,32.01) v1(75.82,69.85) v1(75.82,66.04) v1(75.82,62.23) v1(75.82,58.42) v1(75.82,12.7) v1(75.82,8.89) v1(75.82,5.08) v1(75.82,1.27) v1(79.63,69.85) v1(79.63,66.04) v1(79.63,62.23) v1(79.63,58.42) v1(79.63,39.37) v1(79.63,20.58) v1(79.63,12.7) v1(79.63,8.89) v1(79.63,5.08) v1(79.63,1.27) v1(82.68,20.57) v1(83.44,69.85) v1(83.44,66.04) v1(83.44,62.23) v1(83.44,58.42) v1(83.44,50.8) v1(83.44,27.94) v1(83.44,12.7) v1(83.44,8.89) v1(83.44,5.08) v1(83.44,1.27) v1(87.25,69.85) v1(87.25,66.04) v1(87.25,62.23) v1(87.25,58.42) v1(87.25,54.61) v1(87.25,50.8) v1(87.25,23.5) v1(87.25,20.45) v1(87.25,12.7) v1(87.25,8.89) v1(87.25,5.08) v1(87.25,1.27) v1(90.04,31.16) v1(91.06,69.85) v1(91.06,66.04) v1(91.06,62.23) v1(91.06,58.42) v1(91.06,54.61) v1(91.06,50.8) v1(91.06,27.94) v1(91.06,23.5) v1(91.06,20.45) v1(91.06,16.51) v1(91.06,12.7) v1(91.06,8.89) v1(91.06,5.08) v1(91.06,1.27) v1(94.87,39.63) v1(94.87,31.75) v1(94.87,27.94) v1(94.87,16.51) v1(94.87,12.7) v1(94.87,8.89) v1(94.87,5.08) v1(94.87,1.27) v1(98.68,43.44) v1(98.68,39.63) v1(98.68,31.75) v1(98.68,16.51) v1(98.68,12.7) v1(98.68,8.89) v1(98.68,5.08) v1(98.68,1.27) v1(99.57,27.94) v1(99.57,20.32) v1(102.49,69.85) v1(102.49,66.04) v1(102.49,62.23) v1(102.49,54.87) v1(102.49,47.25) v1(102.49,43.44) v1(102.49,39.63) v1(102.49,31.75) v1(102.49,27.94) v1(102.49,24.13) v1(102.49,20.32) v1(102.49,16.51) v1(102.49,12.7) v1(102.49,8.89) v1(102.49,5.08) v1(102.49,1.27) v1(106.3,70.11) v1(106.3,66.3) v1(106.3,62.49) v1(106.3,58.68) v1(106.3,51.06) v1(106.3,47.25) v1(106.3,43.44) v1(106.3,39.63) v1(106.3,31.75) v1(106.3,27.94) v1(106.3,24.13) v1(106.3,20.32) v1(106.3,16.51) v1(106.3,12.7) v1(106.3,8.89) v1(106.3,5.08) v1(106.3,1.27) v1(110.11,70.11) v1(110.11,66.3) v1(110.11,62.49) v1(110.11,58.68) v1(110.11,54.87) v1(110.11,51.06) v1(110.11,47.25) v1(110.11,43.44) v1(110.11,31.75) v1(110.11,27.94) v1(110.11,24.13) v1(110.11,20.32) v1(110.11,16.51) v1(110.11,8.89) v1(110.11,5.08) v1(110.11,1.27) v1(113.92,70.11) v1(113.92,66.3) v1(113.92,62.49) v1(113.92,58.68) v1(113.92,54.87) v1(113.92,51.06) v1(113.92,47.25) v1(113.92,35.56) v1(113.92,31.75) v1(113.92,27.94) v1(113.92,24.13) v1(113.92,20.32) v1(113.92,8.89) v1(113.92,5.08) v1(113.92,1.27) v1(117.73,70.11) v1(117.73,66.3) v1(117.73,62.49) v1(117.73,58.68) v1(117.73,54.87) v1(117.73,51.06) v1(117.73,39.37) v1(117.73,35.56) v1(117.73,31.75) v1(117.73,27.94) v1(117.73,24.13) v1(117.73,20.32) v1(117.73,16.51) v1(117.73,12.7) v1(117.73,8.89) v1(117.73,5.08) v1(117.73,1.27) v1(121.54,70.11) v1(121.54,66.3) v1(121.54,62.49) v1(121.54,58.68) v1(121.54,54.87) v1(121.54,51.06) v1(121.54,43.18) v1(121.54,39.37) v1(121.54,35.56) v1(121.54,31.75) v1(121.54,27.94) v1(121.54,24.13) v1(121.54,20.32) v1(121.54,16.51) v1(121.54,12.7) v1(121.54,8.89) v1(121.54,5.08) v1(121.54,1.27) v1(125.35,70.11) v1(125.35,66.3) v1(125.35,62.49) v1(125.35,58.68) v1(125.35,54.87) v1(125.35,46.99) v1(125.35,43.18) v1(125.35,39.37) v1(125.35,35.56) v1(125.35,31.75) v1(125.35,27.94) v1(125.35,24.13) v1(125.35,20.32) v1(125.35,16.51) v1(125.35,12.7) v1(125.35,5.08) v1(125.35,1.27) v1(129.16,50.8) v1(129.16,46.99) v1(129.16,43.18) v1(129.16,39.37) v1(129.16,35.56) v1(129.16,31.75) v1(129.16,27.94) v1(129.16,24.13) v1(129.16,20.32) v1(129.16,16.51) v1(129.16,12.7) v1(129.16,8.89) v1(129.16,5.08) v1(129.16,1.27) v1(132.97,69.85) v1(132.97,66.04) v1(132.97,62.23) v1(132.97,58.42) v1(132.97,54.61) v1(132.97,50.8) v1(132.97,46.99) v1(132.97,43.18) v1(132.97,39.37) v1(132.97,35.56) v1(132.97,31.75) v1(132.97,27.94) v1(132.97,24.13) v1(132.97,20.32) v1(132.97,16.51) v1(132.97,12.7) v1(132.97,8.89) v1(132.97,5.08) v1(132.97,1.27) v1(136.78,69.85) v1(136.78,66.04) v1(136.78,62.23) v1(136.78,58.42) v1(136.78,54.61) v1(136.78,50.8) v1(136.78,46.99) v1(136.78,43.18) v1(136.78,39.37) v1(136.78,35.56) v1(136.78,31.75) v1(136.78,27.94) v1(136.78,24.13) v1(136.78,20.32) v1(136.78,16.51) v1(136.78,12.7) v1(136.78,8.89) v1(136.78,5.08) v1(136.78,1.27) v1(140.59,69.85) v1(140.59,66.04) v1(140.59,62.23) v1(140.59,58.42) v1(140.59,54.61) v1(140.59,50.8) v1(140.59,46.99) v1(140.59,43.18) v1(140.59,39.37) v1(140.59,35.56) v1(140.59,31.75) v1(140.59,27.94) v1(140.59,24.13) v1(140.59,20.32) v1(140.59,16.51) v1(140.59,12.7) v1(140.59,8.89) v1(140.59,5.08) v1(140.59,1.27) v1(144.4,69.85) v1(144.4,66.04) v1(144.4,62.23) v1(144.4,58.42) v1(144.4,54.61) v1(144.4,50.8) v1(144.4,46.99) v1(144.4,43.18) v1(144.4,39.37) v1(144.4,35.56) v1(144.4,31.75) v1(144.4,27.94) v1(144.4,24.13) v1(144.4,20.32) v1(144.4,16.51) v1(148.21,69.85) v1(148.21,66.04) v1(148.21,62.23) v1(148.21,58.42) v1(148.21,54.61) v1(148.21,50.8) v1(148.21,46.99) v1(148.21,43.18) v1(148.21,39.37) v1(148.21,35.56) v1(148.21,31.75) v1(148.21,27.94) v1(148.21,24.13) v1(148.21,20.32) v1(148.21,16.51) v2(62.74,37.72) v2(67.31,37.72) v5(44.83,43.81) v5(46.61,43.81)
PGND:
  vias: v1(3.81,152.21) v1(3.81,144.59) v1(3.81,140.78) v1(3.81,133.16) v1(3.81,129.35) v1(3.81,121.73) v1(3.81,117.92) v1(3.81,114.11) v1(3.81,110.3) v1(7.62,144.59) v1(7.62,140.78) v1(7.62,136.97) v1(7.62,133.16) v1(7.62,129.35) v1(7.62,49.66) v1(7.62,45.85) v1(11.43,152.21) v1(11.43,140.78) v1(11.43,136.97) v1(11.43,133.16) v1(11.43,121.73) v1(11.43,117.92) v1(11.43,114.11) v1(11.43,110.3) v1(11.43,49.66) v1(11.43,45.85) v1(15.24,152.21) v1(15.24,148.4) v1(15.24,144.59) v1(15.24,140.78) v1(15.24,136.97) v1(15.24,125.54) v1(15.24,121.73) v1(15.24,117.92) v1(15.24,114.11) v1(15.24,110.3) v1(15.24,49.66) v1(15.24,45.85) v1(19.05,152.21) v1(19.05,148.4) v1(19.05,144.59) v1(19.05,140.78) v1(19.05,136.97) v1(19.05,125.54) v1(19.05,121.73) v1(19.05,117.92) v1(19.05,114.11) v1(19.05,110.3) v1(19.05,49.66) v1(19.05,45.85) v1(22.86,125.54) v1(22.86,121.73) v1(22.86,117.92) v1(22.86,114.11) v1(22.86,110.3) v1(22.86,49.66) v1(22.86,45.85) v1(26.67,148.4) v1(26.67,144.59) v1(26.67,140.78) v1(26.67,136.97) v1(26.67,133.16) v1(26.67,129.35) v1(30.48,148.4) v1(30.48,144.59) v1(30.48,140.78) v1(30.48,136.97) v1(30.48,133.16) v1(30.48,125.54) v1(34.29,148.4) v1(38.1,148.4) v1(38.1,144.59) v1(38.1,140.78) v1(38.1,136.97) v1(38.1,133.16) v1(38.1,129.35) v1(38.1,121.73) v1(38.1,114.11) v1(38.1,110.3) v1(41.91,148.4) v1(41.91,144.59) v1(41.91,140.78) v1(41.91,136.97) v1(41.91,133.16) v1(41.91,129.35) v1(45.72,148.4) v1(45.72,133.16) v1(45.72,129.35) v1(45.72,125.54) v1(45.72,121.73) v1(45.72,117.92) v1(45.72,114.11) v1(45.72,110.3) v1(49.53,148.4) v1(53.34,148.4) v1(53.34,144.59) v1(53.34,140.78) v1(53.34,136.97) v1(60.96,148.4) v1(60.96,144.59) v1(60.96,140.78) v1(60.96,136.97) v1(60.96,133.16) v1(60.96,129.35) v1(60.96,125.54) v1(60.96,121.73) v1(60.96,117.92) v1(60.96,114.11) v1(60.96,110.3) v1(64.77,129.35) v1(64.77,125.54) v1(64.77,114.11) v1(64.77,110.3) v1(68.58,148.4) v1(68.58,144.59) v1(68.58,140.78) v1(68.58,136.97) v1(68.58,129.35) v1(72.39,148.4) v1(76.2,148.4) v1(76.2,114.11) v1(76.2,110.3) v1(80.01,148.4) v1(80.01,144.59) v1(80.01,140.78) v1(80.01,136.97) v1(80.01,133.16) v1(80.01,129.35) v1(80.01,125.54) v1(80.01,121.73) v1(80.01,117.92) v1(80.01,114.11) v1(80.01,110.3) v1(83.82,148.4) v1(83.82,133.16) v1(83.82,129.35) v1(83.82,125.54) v1(83.82,121.73) v1(83.82,117.92) v1(83.82,114.11) v1(83.82,110.3) v1(87.63,148.4) v1(91.44,148.4) v1(91.44,144.59) v1(91.44,140.78) v1(91.44,136.97) v1(93.98,108.33) v1(99.06,148.4) v1(99.06,144.59) v1(99.06,140.78) v1(99.06,136.97) v1(99.06,133.16) v1(99.06,129.35) v1(99.06,125.54) v1(99.06,121.73) v1(99.06,117.92) v1(99.06,114.11) v1(99.06,110.3) v1(102.87,110.3) v1(106.68,148.4) v1(106.68,144.59) v1(106.68,136.97) v1(106.68,114.11) v1(110.49,148.4) v1(110.49,140.78) v1(110.49,136.97) v1(110.49,133.16) v1(110.49,129.35) v1(110.49,125.54) v1(114.3,148.4) v1(118.11,148.4) v1(118.11,136.97) v1(118.11,133.16) v1(118.11,129.35) v1(118.11,125.54) v1(118.11,117.92) v1(118.11,114.11) v1(119.89,107.06) v1(121.92,148.4) v1(121.92,144.59) v1(121.92,140.78) v1(121.92,136.97) v1(121.92,133.16) v1(121.92,129.35) v1(121.92,106.49) v1(123.7,107.06) v1(123.7,103.25) v1(123.7,95.63) v1(123.7,88.01) v1(125.73,148.4) v1(125.73,133.16) v1(129.54,148.4) v1(129.54,144.59) v1(129.54,140.78) v1(129.54,136.97) v1(129.54,129.35) v1(129.54,125.54) v1(129.54,117.92) v1(129.54,114.11) v1(129.54,110.3) v1(131.32,107.06) v1(133.35,152.21) v1(133.35,117.92) v1(133.35,114.11) v1(133.35,110.3) v1(133.35,106.49) v1(135.13,107.06) v1(135.13,103.25) v1(135.13,88.01) v1(135.13,84.2) v1(137.16,152.21) v1(137.16,148.4) v1(137.16,144.59) v1(137.16,140.78) v1(137.16,136.97) v1(137.16,133.16) v1(137.16,129.35) v1(137.16,125.54) v1(137.16,121.73) v1(137.16,117.92) v1(137.16,114.11) v1(137.16,110.3) v1(137.16,106.49) v1(138.94,107.06) v1(138.94,103.25) v1(138.94,99.44) v1(138.94,88.01) v1(138.94,84.2) v1(138.94,76.58) v1(140.97,152.21) v1(140.97,148.4) v1(140.97,144.59) v1(140.97,140.78) v1(140.97,136.97) v1(140.97,133.16) v1(140.97,129.35) v1(140.97,125.54) v1(140.97,121.73) v1(140.97,117.92) v1(140.97,114.11) v1(140.97,110.3) v1(140.97,106.49) v1(142.75,107.06) v1(142.75,103.25) v1(142.75,99.44) v1(142.75,88.01) v1(142.75,76.58) v1(144.78,152.21) v1(144.78,148.4) v1(144.78,144.59) v1(144.78,140.78) v1(144.78,136.97) v1(144.78,133.16) v1(144.78,129.35) v1(144.78,125.54) v1(144.78,121.73) v1(144.78,117.92) v1(144.78,114.11) v1(144.78,110.3) v1(144.78,106.49) v1(146.56,107.06) v1(146.56,103.25) v1(146.56,99.44) v1(146.56,84.2) v1(146.56,76.58) v1(148.59,152.21) v1(148.59,140.78) v1(148.59,136.97) v1(148.59,133.16) v1(148.59,117.92) v1(148.59,114.11) v1(148.59,110.3) v1(148.59,106.49) v1(150.37,107.06) v1(150.37,103.25) v1(150.37,99.44) v1(150.37,95.63) v1(150.37,91.82) v1(150.37,88.01) v1(150.37,84.2) v1(150.37,80.39) v1(150.37,76.58)
VCC: length 533.4
  Top Layer w0.75: v5(30.1,81.92) 29.83,81.64 R40.2
  Top Layer w1: R1.2 30.47,50.8 30.48,50.81 v3(30.48,55.12) ; C3.2 C4.2
  Top Layer w1.27: 38.99,55.12 39.37,54.73 C4.2 38.33,51.56 36.45,51.56 36.45,51.44 36.45,51.43 36.45,51.41
  Top Layer w2.032: CN1.2 17.82,129.19 D1.1
  Top Layer w2.54: v3(30.48,55.12) 38.99,55.12
  Bottom Layer w1.27: v5(30.1,81.92) 30.1,83.86 v5(30.12,83.88) 30.12,94.94 v5(30.2,95.02) v5(30.2,96.96) 30.2,103.15 27.81,105.54 6.22,105.54 5.97,105.28
  Bottom Layer w2.54: 6.98,53.72 5.97,54.74 5.97,121.46 CN1.2 20.23,129.19 21.34,130.3 ; 21.34,130.3 22.2,131.16 U15.2 ; 21.34,130.3 21.34,149.1 24.51,152.27 57.05,152.27 ; 127.13,121.03 127.15,121 U17.13 131.04,121 132.33,122.3 132.33,150.19 130.28,152.25 130.18,152.15 ; 7.1,53.46 29.08,53.46 30.61,54.99 ; U15.13 55.73,121 57.02,122.3 57.02,152.25 57.05,152.27 ; 57.05,152.27 94.56,152.27 ; 94.56,152.27 130.18,152.27 ; 94.56,152.27 94.53,152.25 94.53,122.3 93.23,121 U16.13 ; U16.2 67.85,131.16 64.64,134.37 64.64,152.15 ; 127,121.03 124.45,118.48 124.45,110 133.73,100.71 133.73,99.54 U19.2 133.78,90.79 123.62,80.63 U19.13 ; 102.45,152.15 102.45,134.37 105.65,131.16 U17.2
A+5V: length 176.3
  Top Layer w0.508: 62.53,92.71 C20.1 ; v5(35.31,85.34) 28.96,85.34 v5(28.58,84.96) ; U11.8 45.4,92.78 C17.1 42.73,92.46 v5(42.29,92.46)
  Top Layer w0.75: H2.1 81.99,96.57 CN4.1 79.56,91.19 66.42,91.19 U12.8 56.26,92.71 54.61,91.06 47.12,91.06 U11.8
  Top Layer w1: U5.5 35.23,83.88 C9.1 35.36,85.29 v5(35.31,85.34)
  Bottom Layer w0.508: 9.52,75.05 9.53,75.06 13.46,75.06 14.6,73.91 14.6,73.06 R24.3 ; 9.52,75.05 9.52,62.27 R29.3 ; 9.52,75.05 9.52,87.17 ; 9.52,87.17 R19.3 ; 9.52,87.17 9.52,99.61 ; R14.3 9.52,99.61 ; 9.52,99.61 9.52,102.87 10.92,104.27 26.54,104.27 28.58,102.23 v5(28.58,84.96)
  Bottom Layer w1: U11.8 45.21,92.46 v5(42.29,92.46) 42.29,92.33 v5(35.31,85.34)
ADC1_IN8: length 82.5
  Top Layer w0.305: v1(118.87,102.87) 118.87,103.33 118.7,103.5 ; U14.35 81.64,46.84 v1(83.06,48.26)
  Bottom Layer w0.305: v1(83.06,48.26) 83.57,48.77 92.08,48.77 105.41,62.1 105.41,92.2 110.36,97.16 117.09,97.16 118.87,98.93 v1(118.87,102.87)
ADC1_IN9: length 74.8
  Top Layer w0.305: v1(82.42,48.9) 82.42,48.77 81.14,47.48 U14.36 ; 108.54,103.5 109.09,102.95 v1(109.09,102.87)
  Bottom Layer w0.305: v1(82.42,48.9) 83.06,49.53 91.69,49.53 104.52,62.36 104.52,93.98 109.09,98.55 109.09,102.74
ADC1_IN12: length 68.3
  Top Layer w0.305: v1(86.23,39.24) 86.84,39.85 U14.17 ; 107.31,93.64 107.53,93.64 v1(107.82,93.34)
  Bottom Layer w0.305: v1(107.82,93.34) 108.08,93.09 108.08,56.39 91.19,39.5 86.49,39.5 v1(86.23,39.24)
ADC1_IN13: length 52.3
  Top Layer w0.305: 107.31,77.77 107.31,77.72 v1(107.19,77.6) ; U14.18 86.07,40.35 v1(85.6,39.88)
  Bottom Layer w0.305: v1(85.6,39.88) 85.73,40 90.68,40 107.44,56.77 107.44,77.34 v1(107.19,77.6)
ADC_IN15: length 79
  Top Layer w0.305: 66.04,41.4 63.25,44.2 63.25,53.34 45.29,71.29 36.07,71.29 C43.2 ; v1(82.17,44.32) 82.17,45.36 U14.34
  Top Layer w0.75: C43.2 31.29,77.18 30.36,78.11 30.1,77.84 R41.2 R40.1
  Bottom Layer w0.305: v1(66.04,41.53) 67.95,43.43 81.28,43.43 v1(82.17,44.32)
ADC_IN_HALL_1: length 84.1
  Top Layer w0.305: v1(46.74,93.22) 46.74,93.35 R22.1 ; v1(46.74,74.93) 66.09,55.58 ; 66.09,55.58 66.09,43.89 v1(68.45,41.53) ; 66.09,55.58 66.17,55.5 ; v1(84.71,43.18) 84.71,44.59 84.64,44.66 U14.29
  Top Layer w0.75: R22.1 R23.2
  Bottom Layer w0.305: v1(46.74,93.22) v1(46.74,74.93) ; v1(68.45,41.53) 83.06,41.53 v1(84.71,43.18)
ADC_IN_HALL_2: length 74.6
  Top Layer w0.305: v1(84.07,44.2) 84.07,44.62 84.14,44.68 U14.30 ; v1(44.07,74.93) 64.64,54.36 64.64,44.07 v1(67.18,41.53)
  Top Layer w0.75: R17.1 R18.2
  Bottom Layer w0.305: v1(41.91,84.96) 44.07,82.8 44.07,75.06 ; 84.07,44.07 82.55,42.55 68.2,42.55 v1(67.18,41.53)
ADC_IN_HALL_3: length 60
  Top Layer w0.305: 75.26,55.68 75.26,54.79 77.98,52.07 v1(77.98,50.93) ; 75.26,55.68 75.31,55.63 ; 75.26,55.68 66.17,64.77 v1(66.17,74.93) ; U14.31 83.64,46.35 83.69,46.4 v1(83.69,46.61) ; v1(66.17,93.22) 64.78,94.61 R32.1
  Top Layer w0.75: R32.1 R33.2
  Bottom Layer w0.305: v1(83.69,46.61) 79.37,50.93 v1(77.98,50.93) ; v1(66.17,93.22) v1(66.17,74.93)
ADC_IN_HALL_4: length 50.6
  Top Layer w0.305: v1(77.34,50.29) 77.34,51.94 74.3,54.99 74.3,55.63 65.4,64.52 v1(65.4,74.93) ; U14.33 82.68,45.44 82.68,46.35 v1(82.42,46.61)
  Top Layer w0.75: R27.1 R28.2
  Bottom Layer w0.305: v1(77.34,50.29) 78.74,50.29 v1(82.42,46.61) ; v1(65.4,74.93) 65.4,80.16 v1(61.05,84.51)
ALT_1_A: length 12.1
  Bottom Layer w2.032: U17.8 125.2,136.73 CN7.1
ALT_1_B: length 39.3
  Top Layer w0.508: U20.3 117.4,110.81 116.33,111.89 115.17,111.89 R43.1
  Top Layer w2.032: CN7.2 114.66,138.98 R43.1
ALT_1_B_CS: length 27.3
  Top Layer w0.508: R43.2 120.29,111.89 119.25,111.89 118.05,110.69 U20.2
  Top Layer w2.032: R43.2 120.8,124.86 127.13,131.19 128.2,131.19 U17.9
ALT_2_A: length 31.9
  Bottom Layer w2.032: CN7.3 115.19,144.5 115.19,121.67 111.99,118.46 U17.7
ALT_2_B: length 39.3
  Top Layer w0.508: U21.3 107.24,110.69 106.05,111.89 105.01,111.89 R44.1
  Top Layer w2.032: R44.1 104.5,138.82 CN7.4
ALT_2_B_CS: length 15.7
  Top Layer w0.508: U21.2 107.89,110.69 109.09,111.89 110.13,111.89 R44.2
  Top Layer w2.032: R44.2 110.62,112.41 110.62,119.51 109.12,121 U17.6
ALT_3_A: length 38.2
  Top Layer w0.508: 116.24,96.3 114.88,94.94 U22.3 ; 116.24,96.3 116.33,96.39 ; 116.24,96.3 116.24,97.46 R45.1
  Top Layer w2.032: CN10.3 147.15,92.46 121.68,92.46 R45.1
ALT_3_A_CS: length 15
  Top Layer w0.508: v3(116.46,91.55) 116.46,92.84 115.01,94.29 U22.2
  Bottom Layer w2.032: U19.7 121.08,96.17 v3(116.46,91.55)
ALT_3_B: length 24.7
  Top Layer w2.032: U19.6 123.62,99.21 125.55,97.28 146.97,97.28 CN10.4
ALT_4_A: length 12.4
  Top Layer w2.032: U19.8 143.42,78.73 CN10.1
ALT_4_B: length 38.3
  Top Layer w0.508: 113.16,79.06 115.01,79.06 116.2,80.26 116.2,81.55 R46.1
  Top Layer w2.032: R46.1 141.5,81.81 CN10.2
ALT_4_B_CS: length 25
  Top Layer w0.508: U23.2 115.01,78.42 116.33,77.09 116.33,75.8 R46.2
  Top Layer w2.032: R46.2 116.82,75.31 132,75.31 133.78,77.09 U19.9
BLE_KEY: length 26.6
  Top Layer w0.305: U14.84 78.14,26.26 85.22,19.18 93.85,19.18 96.01,17.02 H4.6
BLE_STATE: length 39.1
  Top Layer w0.305: H4.1 98.81,27.81 98.81,19.18 97.79,18.16 96.27,18.16 94.61,19.81 85.47,19.81 78.64,26.65 U14.85
BOOT0: length 40.7
  Top Layer w0.305: R39.1 56.29,16.09 SW3.2 ; 83.18,30.99 83.14,30.99 83.14,31.16 80.64,33.66 v1(79.37,33.66)
  Top Layer w0.635: R39.1 v1(55.5,17.53)
  Bottom Layer w0.305: v1(55.5,17.53) 60.26,17.53 76.39,33.66 v1(79.37,33.66)
ENC_A: length 27.6
  Top Layer w0.305: CN9.7 58.92,39.85 72.59,39.85
ENC_B: length 24.9
  Top Layer w0.305: 72.59,39.35 60.92,39.35 CN9.8
ENC_KEY: length 30.3
  Top Layer w0.305: CN9.6 56.92,40.35 72.59,40.35
HALL_IN1: length 44
  Top Layer w0.75: CN4.3 86.99,96.65 H2.3 84.2,99.44 55.87,99.44 R20.1
HALL_IN2: length 52.3
  Top Layer w0.75: R15.1 50.54,80.53 52.2,78.87 79.61,78.87 CN4.4 89.49,96.69 H2.4
HALL_IN3: length 28.9
  Top Layer w0.75: H2.5 91.99,96.73 CN4.5 ; R30.1 72.64,96.65 v5(73.02,97.03)
  Bottom Layer w0.75: v5(73.02,97.03) 73.02,97.16 74.3,98.42 90.3,98.42 H2.5
HALL_IN4: length 36
  Top Layer w0.75: R25.1 71.5,80.9
  Bottom Layer w0.75: v5(71.63,80.9) 87.76,80.9 94.49,87.63 H2.6
I2C2_SCL: length 11.2
  Top Layer w0.305: CN3.4 80.77,51.81 75.64,46.68 U14.47
I2C2_SDA: length 11
  Top Layer w0.305: U14.48 75.14,47.07 79.76,51.7 CN3.3
IMU_INT: length 14.1
  Top Layer w0.305: U14.97 84.64,29.34 84.58,29.29 v1(84.58,29.08)
  Bottom Layer w0.305: v1(84.58,29.08) 84.58,19.05 H1.7
NRST: length 58.1
  Top Layer w0.305: U14.14 87.68,38.35 84.96,38.35 v1(82.17,35.56) ; R37.2 49.95,4.54 SW1.1 53.39,6.01 C40.2 53.47,8.71 v1(53.47,9.09) 53.47,10.3 R42.1 51.61,10.41 U18.2
  Bottom Layer w0.305: v1(53.47,9.09) 56.09,11.71 57.67,11.71 76.43,30.47 76.43,32.05 77.42,33.05 79.63,33.05 80.75,34.16 80.75,34.29 81.38,34.93 81.38,35.43 81.48,35.53 81.49,35.53 81.52,35.56 v1(82.17,35.56)
OLED_SCL: length 57.1
  Top Layer w0.305: 41.55,27.08 CN9.4 ; 41.55,27.08 41.55,23.9 H8.3 ; 41.55,27.08 R6.1 ; U14.92 82.14,29.18 v1(82.04,29.08) ; v1(80.14,34.42) 81.03,34.42 v1(82.04,33.4)
  Bottom Layer w0.305: v1(82.04,33.4) v1(82.04,29.08) ; CN9.4 42.95,28.57 67.56,28.57 73.41,34.42 v1(80.14,34.42)
OLED_SDA: length 58.7
  Top Layer w0.305: H8.4 44.05,23.86 CN9.5 44.19,30.11 R7.1 ; U14.93 82.64,29.34 82.8,29.18 v1(82.8,29.08) ; v1(82.68,34.04) 81.53,35.18 v1(80.77,35.18)
  Bottom Layer w0.305: v1(82.68,34.04) 82.8,33.91 v1(82.8,29.08) ; v1(80.77,35.18) 80.64,35.31 73.02,35.31 70.1,32.38 46.46,32.38 CN9.5
OSC_IN: length 4.7
  Top Layer w0.305: U14.12 88.77,37.35 89.03,37.08 90.69,37.08 X1.3
OSC_OUT: length 4.1
  Top Layer w0.305: U14.13 88.65,37.85 89.03,38.23 89.03,39.37 X1.1
PA0: length 134.4
  Top Layer w0.305: U14.23 86.73,42.85 86.69,42.8 v1(86.61,42.8) ; U8.8 35.65,106.05 92.46,106.05 98.04,100.46 v1(98.04,49.4)
  Bottom Layer w0.305: v1(86.61,42.8) 91.44,42.8 v1(98.04,49.4)
PA1: length 108.9
  Top Layer w0.305: v1(88.93,43.69) 88.58,43.35 U14.24 ; v1(97.41,49.91) 97.41,100.08 92.08,105.41 55.84,105.41 U7.8
  Bottom Layer w0.305: v1(97.41,49.91) 91.19,43.69 v1(88.93,43.69)
PA2: length 90.1
  Top Layer w0.305: v1(96.77,50.55) 96.77,99.7 91.69,104.78 71.8,104.78 70.65,103.63
  Bottom Layer w0.305: v1(87.25,44.2) 87.38,44.32 90.68,44.32 96.77,50.42 v1(96.77,50.55)
PA3: length 66.5
  Top Layer w0.305: U9.8 91.83,103.63 96.14,99.32 96.14,51.82 ; v1(86.49,45.59) 86.29,45.4 U14.26
  Bottom Layer w0.305: v1(96.01,51.56) 92.58,48.13 89.03,48.13 v1(86.49,45.59)
PA7: length 96.8
  Top Layer w0.305: v1(91.44,113.28) 91.44,125.07 U16.11 ; v1(83.18,44.2) 83.18,44.4 83.14,44.44 U14.32 ; v1(98.81,53.47) 98.81,105.92 v1(97.54,107.19)
  Bottom Layer w0.305: v1(83.18,44.2) 83.82,44.83 90.17,44.83 v1(98.81,53.47) ; v1(91.44,113.28) v1(97.54,107.19)
PA9: length 71.3
  Top Layer w0.305: v1(71.37,35.43) 71.55,35.43 71.63,35.35 72.59,35.35
  Bottom Layer w0.305: v1(71.37,35.43) 6.35,35.43 H3.4
PA10: length 72.1
  Top Layer w0.305: 72.59,34.85 71.8,34.85 71.76,34.8 71.5,34.8 v1(71.37,34.67)
  Bottom Layer w0.305: H3.5 7.37,33.91 70.61,33.91 v1(71.37,34.67)
PA15: length 32.1
  Top Layer w0.305: U14.77 74.64,29.34 74.68,29.3 v1(74.68,26.54) ; C41.2 64.95,6.05 SW2.1 61.4,4.57 R38.2
  Bottom Layer w0.305: v1(74.68,26.54) 64.9,16.76 v1(64.9,9.27)
PB3: length 19.5
  Top Layer w0.305: v1(80.64,32.26) 80.64,30.3 U14.89
  Bottom Layer w0.305: H1.3 76.2,17.27 76.2,28.45 80.01,32.26 v1(80.64,32.26)
PB4: length 13.4
  Top Layer w0.305: U14.90 81.15,30.28 v1(81.15,29.08)
  Bottom Layer w0.305: H1.5 81.53,28.57 81.15,28.96 v1(81.15,29.08)
PB5: length 17.8
  Top Layer w0.305: v1(81.41,31.62) 81.64,31.39 U14.91
  Bottom Layer w0.305: v1(81.41,31.62) 80.14,31.62 78.99,30.48 H1.4
PB8: length 98.1
  Top Layer w0.305: U14.95 83.64,31.69 v1(83.69,31.75)
  Bottom Layer w0.305: U19.5 126.24,99.42 126.24,88.77 118.87,81.41 118.87,49.02 106.68,36.83 89.41,36.83 87.25,34.67 85.34,34.67 83.69,33.02 v1(83.69,31.75)
PB9: length 99.4
  Top Layer w0.305: U14.96 84.14,31.31 v1(84.45,31.62)
  Bottom Layer w0.305: v1(84.45,31.62) 84.45,32.89 85.6,34.04 87.63,34.04 89.79,36.19 107.7,36.19 119.96,48.46 119.96,80.59 128.78,89.41 128.78,99.42 U19.4
PB14: length 119.3
  Top Layer w0.305: 72.59,42.85 72.63,42.89 78.52,42.89 v1(82.68,38.74) ; v1(100.33,119) 100.33,40.13 v1(100.46,40)
  Bottom Layer w0.305: 100.46,39.88 99.57,38.99 88.39,38.99 88.01,38.61 82.8,38.61 v1(82.68,38.74) ; U17.4 100.38,119 v1(100.33,119)
PB15: length 139.7
  Top Layer w0.305: v1(112.14,116.46) 112.39,116.2 112.39,97.66 111.25,96.52 v1(111.25,48.66) ; 72.59,42.35 78.18,42.35 81.66,38.86 v1(81.66,36.83)
  Bottom Layer w0.305: v1(111.25,48.66) 111.25,43.18 106.05,37.97 88.9,37.97 87.63,36.7 81.79,36.7 v1(81.66,36.83) ; U17.10 124.43,128.62 112.27,116.46
PC6: length 114.5
  Top Layer w0.305: 72.59,37.85 73.79,37.85 v1(73.91,37.97) ; v1(99.57,49.91) 99.57,106.81 v1(99.19,107.19) ; v1(92.08,114.3) 92.08,126.97 U16.10
  Bottom Layer w0.305: v1(99.57,49.91) 90.17,40.51 76.45,40.51 v1(73.91,37.97) ; v1(99.19,107.19) v1(92.08,114.3)
PC7: length 116
  Top Layer w0.305: 72.59,37.35 79.76,37.35 v1(80.26,37.85) ; v1(101.22,39.75) v1(101.22,117.35)
  Bottom Layer w0.305: v1(80.26,37.85) 80.52,38.1 88.39,38.1 88.77,38.48 99.95,38.48 v1(101.22,39.75) ; v1(101.22,117.35) 101.27,117.35 U17.5
PC8: length 135.6
  Top Layer w0.305: v1(81.15,36.07) 80.37,36.85 72.59,36.85 ; v1(113.16,116.46) 112.9,116.2 112.9,97.03 111.89,96.01 v1(111.89,49.4)
  Bottom Layer w0.305: v1(111.89,49.4) 111.89,42.93 106.43,37.47 89.15,37.47 87.88,36.19 81.28,36.19 v1(81.15,36.07) ; v1(113.16,116.46) 122.78,126.08 U17.11
PD0: length 52.4
  Top Layer w0.305: U14.81 76.64,27.49 68.58,19.43 47.4,19.43 43.59,15.62 39.9,15.62 R35.1
PD1: length 48.9
  Top Layer w0.305: U14.82 77.14,26.97 68.43,18.26 46.81,18.26 R36.1
PD5: length 29
  Top Layer w0.305: U14.86 79.14,27.16 84.33,21.97 94.74,21.97 96.01,23.24 97.66,23.24 98.17,23.75 98.17,25.91 H4.2
PD6: length 21.1
  Top Layer w0.305: H4.3 82.8,24.64 79.64,27.81 U14.87
PD7: length 19.4
  Top Layer w0.305: U14.88 80.14,29.21 v1(80.26,29.08)
  Bottom Layer w0.305: 80.14,28.96 80.26,28.83 80.26,15.88 81.15,14.99 82.04,14.99 H1.6
PD8: length 22.1
  Top Layer w0.305: 72.59,41.85 71.63,41.85 70.36,43.12 70.36,47.83 70.79,48.26 72.64,48.26 76.07,51.69 v1(76.07,52.32) ; CN3.5 81.77,53.95 v1(81.66,53.85)
  Bottom Layer w0.305: v1(76.07,52.32) 80.14,52.32 81.53,53.72
PD9: length 25.2
  Top Layer w0.305: v1(75.31,52.07) 72.14,48.9 70.48,48.9 69.6,48.01 69.6,43.05 71.3,41.35 72.59,41.35 ; v1(82.68,53.85) 82.77,53.94 CN3.6
  Bottom Layer w0.305: v1(75.31,52.07) 75.82,51.56 80.52,51.56 82.68,53.72
PE5: length 78.5
  Top Layer w0.305: U14.4 86.73,33.35 86.36,32.97 v1(86.36,32.77)
  Bottom Layer w0.305: U19.10 131.24,56.69 109.47,34.93 90.42,34.93 88.27,32.77 v1(86.36,32.77)
PE6: length 77.2
  Top Layer w0.305: v1(85.85,33.4) 86.3,33.85 U14.5
  Bottom Layer w0.305: U19.11 128.7,55.68 108.58,35.56 90.17,35.56 88.01,33.4 v1(85.85,33.4)
PE8: length 99.8
  Top Layer w0.305: U14.39 79.64,46.35 79.76,46.47 v1(79.76,46.61) ; v1(58.17,74.93) 58.29,74.8 58.29,70.48 73.28,55.5 73.28,53.09 73.79,52.58 ; U15.11 v1(47.27,126.08)
  Bottom Layer w0.305: v1(47.27,126.08) 47.27,106.02 58.17,95.12 v1(58.17,74.93) ; v1(73.91,52.58) 73.91,52.45 v1(79.76,46.61)
PE9: length 102.9
  Top Layer w0.305: v1(47.24,128.65) 47.27,128.62 U15.10 ; v1(78.87,46.61) 79.14,46.34 U14.40 ; v1(57.4,74.93) 57.4,70.23 72.14,55.5 72.14,53.21 73.28,52.07
  Bottom Layer w0.305: v1(57.4,74.93) 57.4,94.62 46.35,105.66 46.35,127.76 v1(47.24,128.65) ; v1(78.87,46.61) 73.66,51.82 73.41,51.82 v1(73.28,51.94)
PE10: length 108
  Top Layer w0.305: v1(78.87,44.2) 78.87,44.32 78.61,44.58 78.61,45.37 U14.41 ; 72.64,51.44 70.87,53.21 70.87,55.5 56.13,70.23 v1(56.13,74.93) ; v1(37.56,126.08) v1(41.78,126.08)
  Bottom Layer w0.305: v1(78.87,44.2) 78.87,45.21 v1(72.77,51.31) ; v1(41.78,126.08) 42.67,125.19 42.67,106.05 56.13,92.58 v1(56.13,74.93) ; U15.4 v1(37.56,126.08)
PE11: length 105.3
  Top Layer w0.305: v1(55.37,74.93) 55.37,69.85 69.72,55.5 69.72,53.21 v1(72.14,50.8) ; v1(78.08,44.2) 78.14,44.25 U14.42 ; v1(37.59,123.57) v1(41.78,123.57)
  Bottom Layer w0.305: v1(37.59,123.57) 37.56,123.54 U15.5 ; v1(78.08,44.2) 78.08,44.86 v1(72.14,50.8) ; v1(41.78,123.57) 41.78,105.79 55.37,92.2 v1(55.37,74.93)
PE12: length 92.5
  Top Layer w0.305: v1(85.47,82.42) 85.36,82.31 85.36,54.62 77.64,46.9 U14.43
  Bottom Layer w0.305: v1(85.47,82.42) 85.47,82.93 64.14,104.27 64.14,118.01 U16.5
PE13: length 95.2
  Top Layer w0.305: U14.44 77.14,47.29 84.71,54.86 84.71,81.53 v1(84.2,82.04)
  Bottom Layer w0.305: 84.2,82.3 84.2,82.68 63.12,103.76 63.12,119.54 U16.4
SWCLK: length 78.7
  Top Layer w0.305: v1(73.9,32.03) 74.14,31.8 U14.76
  Bottom Layer w0.305: v1(73.9,32.03) 73.9,31.75 60.7,18.54 H7.3
SWDIO: length 77.1
  Top Layer w0.305: 72.59,33.35 73.61,33.35 v1(73.66,33.4)
  Bottom Layer w0.305: v1(73.66,33.4) 61.34,21.08 H7.2
TPS_EN: length 4.2
  Top Layer w0.508: R2.2 32.37,50.8 32.64,50.8 33.27,50.16 34.15,50.16 U3.5
TPS_SW: length 9.7
  Top Layer w1: 38.07,44.89 37.85,45.12 37.85,49.82 37.49,50.18 U3.2 ; 38.07,44.89 L1.1 ; 38.07,44.89 C5.1
X+_A: length 15.9
  Top Layer w2.032: 82.33,144.51 82.33,138.82 87.45,133.7 U16.8
X+_B: length 36.9
  Top Layer w0.508: U9.3 90.1,110.69 88.9,111.89 87.87,111.89 v3(87.36,112.39)
  Bottom Layer w2.032: 87.16,144.51 87.36,144.32 v3(87.36,112.39)
X+_B_CS: length 25.5
  Top Layer w0.508: R12.2 92.98,111.89 92.08,111.89 90.75,110.56 U9.2
  Top Layer w2.032: 93.66,112.39 93.64,112.41 93.64,129.41 91.89,131.16 U16.9
X-_A: length 36.7
  Top Layer w0.508: v3(50.02,112.39) 50.65,111.76 51.44,111.76 52.76,110.43 U7.3
  Bottom Layer w2.032: v3(50.02,112.39) 50.02,144.32 CN5.1
X-_A_CS: length 25.5
  Top Layer w0.508: R10.2 55.52,111.76 54.74,111.76 53.41,110.43 U7.2
  Top Layer w2.032: R10.2 56.13,112.41 56.13,129.41 54.38,131.16 U15.9
X-_B: length 15.9
  Top Layer w2.032: U15.8 49.94,133.7 44.82,138.82 CN5.2
Y+_A: length 43.9
  Top Layer w0.508: 66.55,112.52 67.18,111.89 68.07,111.89 69.35,110.61 U10.3
  Bottom Layer w2.032: 66.55,112.52 71.04,112.52 77.27,118.75 77.27,144.58 77.21,144.64
  vias: v3(66.58,112.39)
Y+_B: length 28.3
  Top Layer w2.032: 69.64,118.44 U16.7 70.88,118.46 72.79,120.37 72.79,144 72.3,144.48
Y-_A: length 28.3
  Top Layer w2.032: U15.7 32.18,118.49 33.4,118.49 35.31,120.4 35.31,144.03 CN5.4
